# EAGLE schematic firefly-instrument-tray (EAGLE 7.7.0)

## Sheet 1 of 8
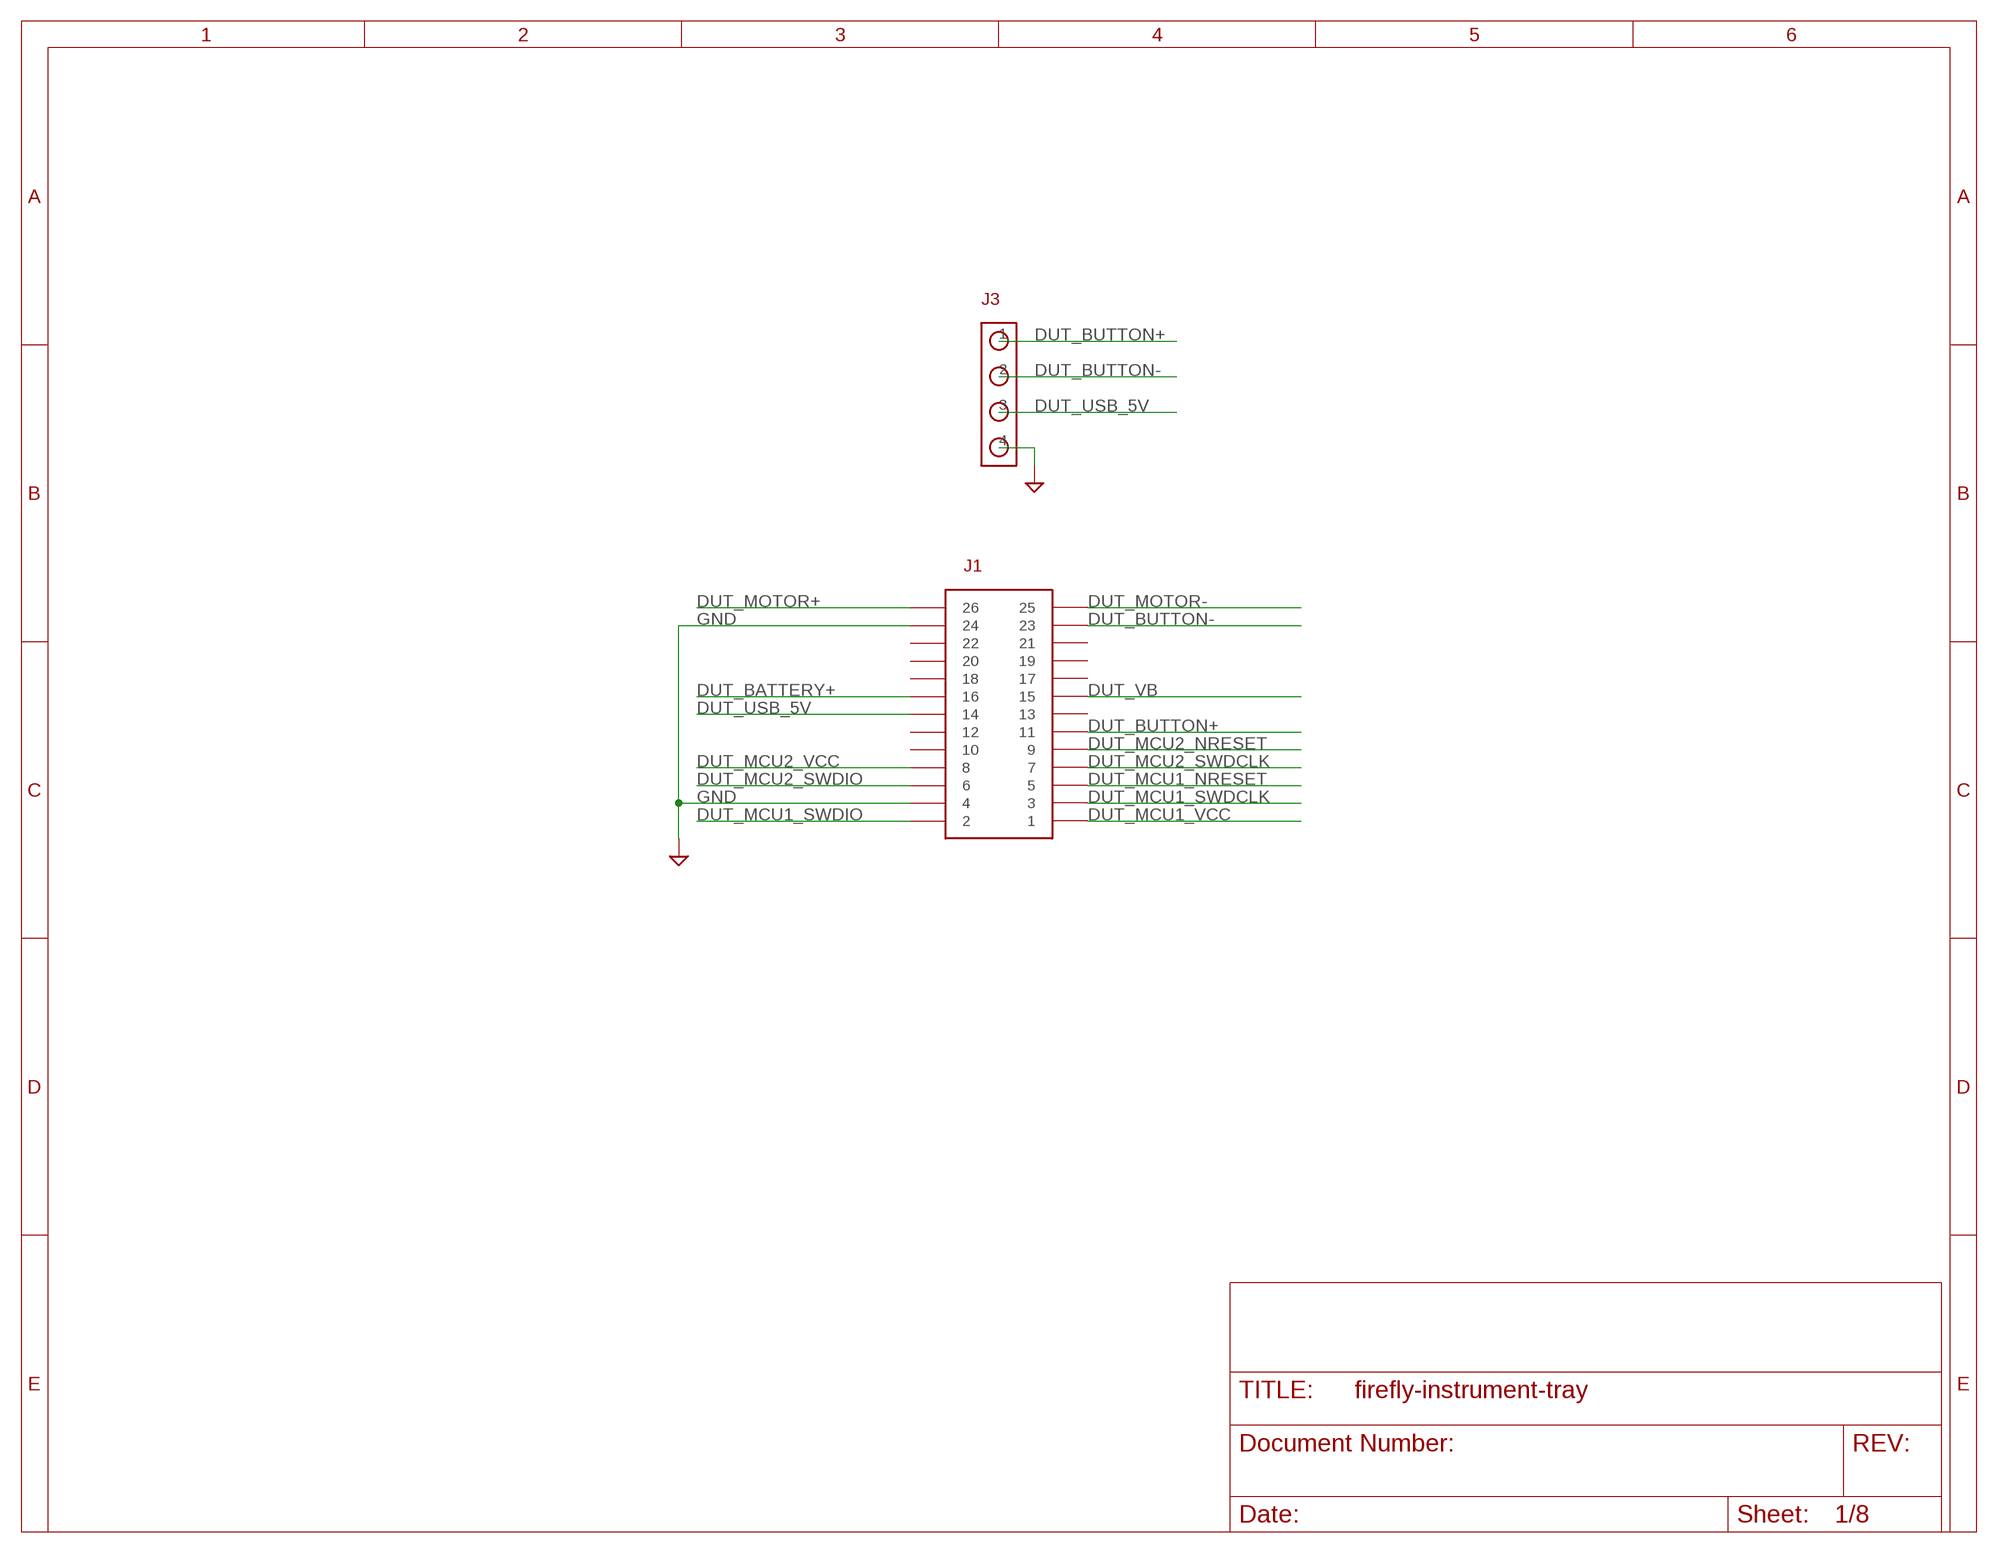
[diagram p0: schematic, sheet 1]

### Parts
J1  CON-26  [CON-HEADER-2X13]
J3  CON-4282847-4  [282847-4]

### Nets
DUT_BATTERY+: J1.16 ; also sheet 3
DUT_BUTTON+: J1.11 J3.1 ; also sheet 2
DUT_BUTTON-: J1.23 J3.2 ; also sheet 2
DUT_MCU1_NRESET: J1.5 ; also sheet 2
DUT_MCU1_SWDCLK: J1.3 ; also sheet 2
DUT_MCU1_SWDIO: J1.2 ; also sheet 2
DUT_MCU1_VCC: J1.1 ; also sheet 2
DUT_MCU2_NRESET: J1.9 ; also sheet 2
DUT_MCU2_SWDCLK: J1.7 ; also sheet 2
DUT_MCU2_SWDIO: J1.6 ; also sheet 2
DUT_MCU2_VCC: J1.8 ; also sheet 2
DUT_MOTOR+: J1.26 ; also sheet 2
DUT_MOTOR-: J1.25 ; also sheet 2
DUT_USB_5V: J1.14 J3.3 ; also sheet 4
DUT_VB: J1.15 ; also sheet 2
GND: J1.4 J1.24 J3.4 ; also sheet 2,3,4,5,6,7,8
Unconnected: J1.10 J1.12 J1.13 J1.17 J1.18 J1.19 J1.20 J1.21 J1.22

## Sheet 2 of 8
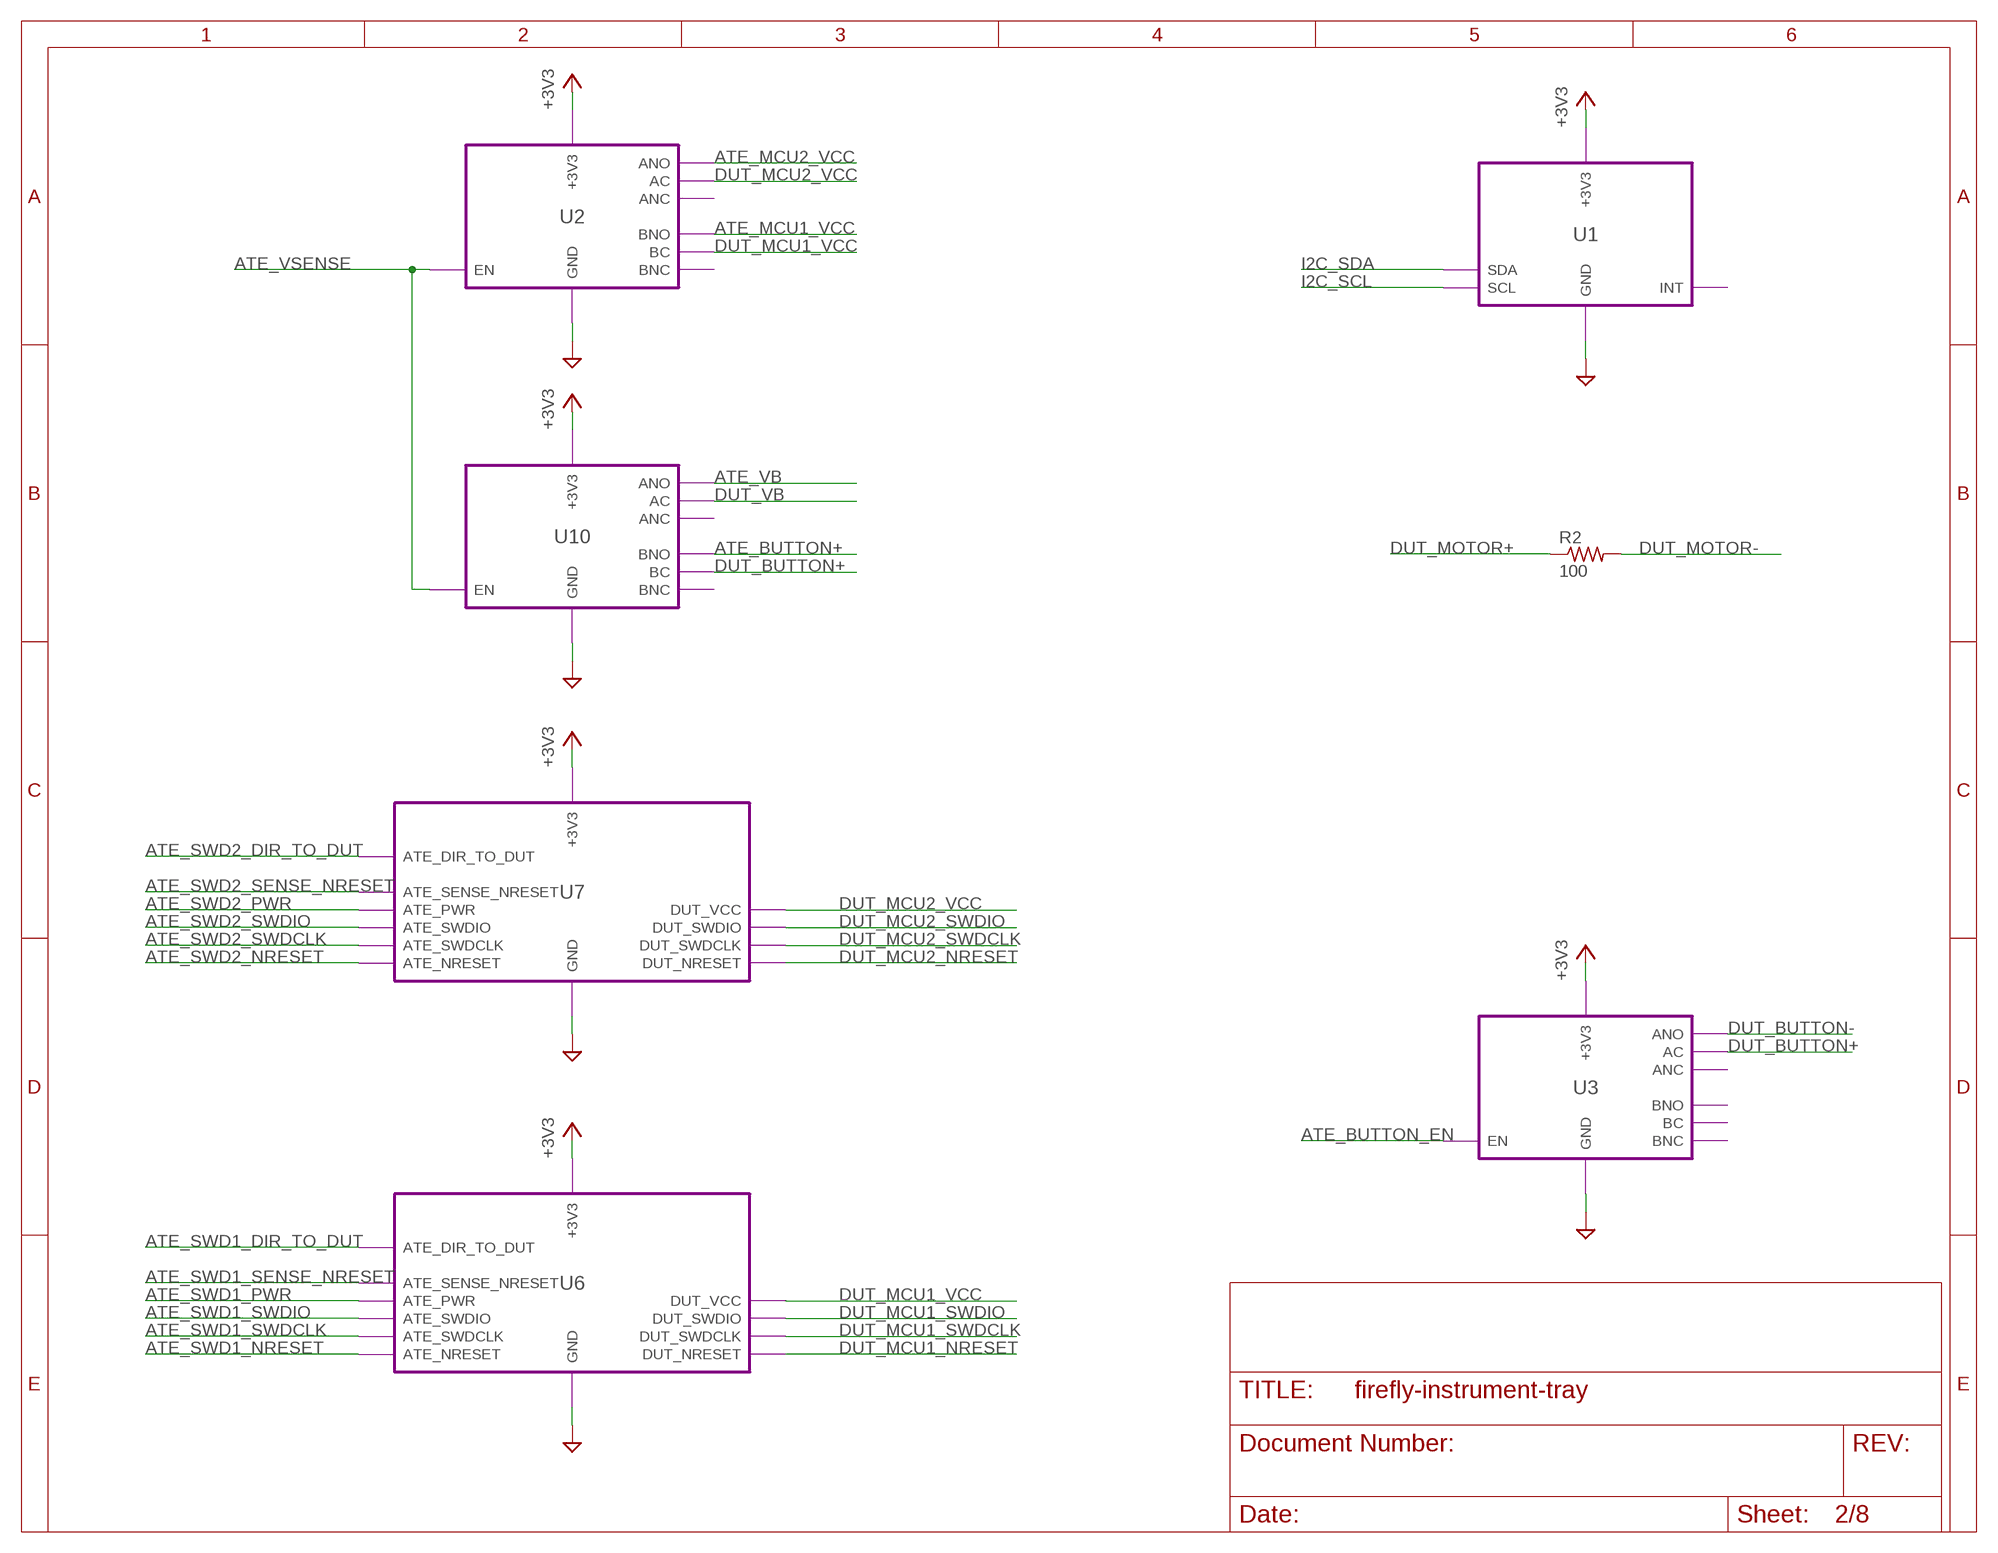
[diagram p1: schematic, sheet 2]

### Parts
R2  100  R-USRW0S6BB  [RW0S6BB]

### Module instances
U6 = SERIAL_WIRE_DEBUG
U3 = RELAY
U7 = SERIAL_WIRE_DEBUG
U1 = COLOR_SENSOR
U2 = RELAY
U10 = RELAY

### Nets
+3V3: port U1.+3V3 U6.+3V3 U7.+3V3 U3.+3V3 U2.+3V3 U10.+3V3 ; also sheet 3,4,5,6,7,8
ATE_BUTTON+: port U10.BNO ; also sheet 6
ATE_BUTTON_EN: port U3.EN ; also sheet 5
ATE_MCU1_VCC: port U2.BNO ; also sheet 6
ATE_MCU2_VCC: port U2.ANO ; also sheet 6
ATE_SWD1_DIR_TO_DUT: port U6.ATE_DIR_TO_DUT ; also sheet 5
ATE_SWD1_NRESET: port U6.ATE_NRESET ; also sheet 5
ATE_SWD1_PWR: port U6.ATE_PWR ; also sheet 5
ATE_SWD1_SENSE_NRESET: port U6.ATE_SENSE_NRESET ; also sheet 5
ATE_SWD1_SWDCLK: port U6.ATE_SWDCLK ; also sheet 5
ATE_SWD1_SWDIO: port U6.ATE_SWDIO ; also sheet 5
ATE_SWD2_DIR_TO_DUT: port U7.ATE_DIR_TO_DUT ; also sheet 5
ATE_SWD2_NRESET: port U7.ATE_NRESET ; also sheet 5
ATE_SWD2_PWR: port U7.ATE_PWR ; also sheet 5
ATE_SWD2_SENSE_NRESET: port U7.ATE_SENSE_NRESET ; also sheet 5
ATE_SWD2_SWDCLK: port U7.ATE_SWDCLK ; also sheet 5
ATE_SWD2_SWDIO: port U7.ATE_SWDIO ; also sheet 5
ATE_VB: port U10.ANO ; also sheet 6
ATE_VSENSE: port U10.EN U2.EN ; also sheet 5
DUT_BUTTON+: port U3.AC U10.BC ; also sheet 1
DUT_BUTTON-: port U3.ANO ; also sheet 1
DUT_MCU1_NRESET: port U6.DUT_NRESET ; also sheet 1
DUT_MCU1_SWDCLK: port U6.DUT_SWDCLK ; also sheet 1
DUT_MCU1_SWDIO: port U6.DUT_SWDIO ; also sheet 1
DUT_MCU1_VCC: port U6.DUT_VCC U2.BC ; also sheet 1
DUT_MCU2_NRESET: port U7.DUT_NRESET ; also sheet 1
DUT_MCU2_SWDCLK: port U7.DUT_SWDCLK ; also sheet 1
DUT_MCU2_SWDIO: port U7.DUT_SWDIO ; also sheet 1
DUT_MCU2_VCC: port U7.DUT_VCC U2.AC ; also sheet 1
DUT_MOTOR+: R2.1 ; also sheet 1
DUT_MOTOR-: R2.2 ; also sheet 1
DUT_VB: port U10.AC ; also sheet 1
GND: port U1.GND U6.GND U7.GND U3.GND U2.GND U10.GND ; also sheet 1,3,4,5,6,7,8
I2C_SCL: port U1.SCL ; also sheet 3,4,5,7
I2C_SDA: port U1.SDA ; also sheet 3,4,5,7

## Sheet 3 of 8
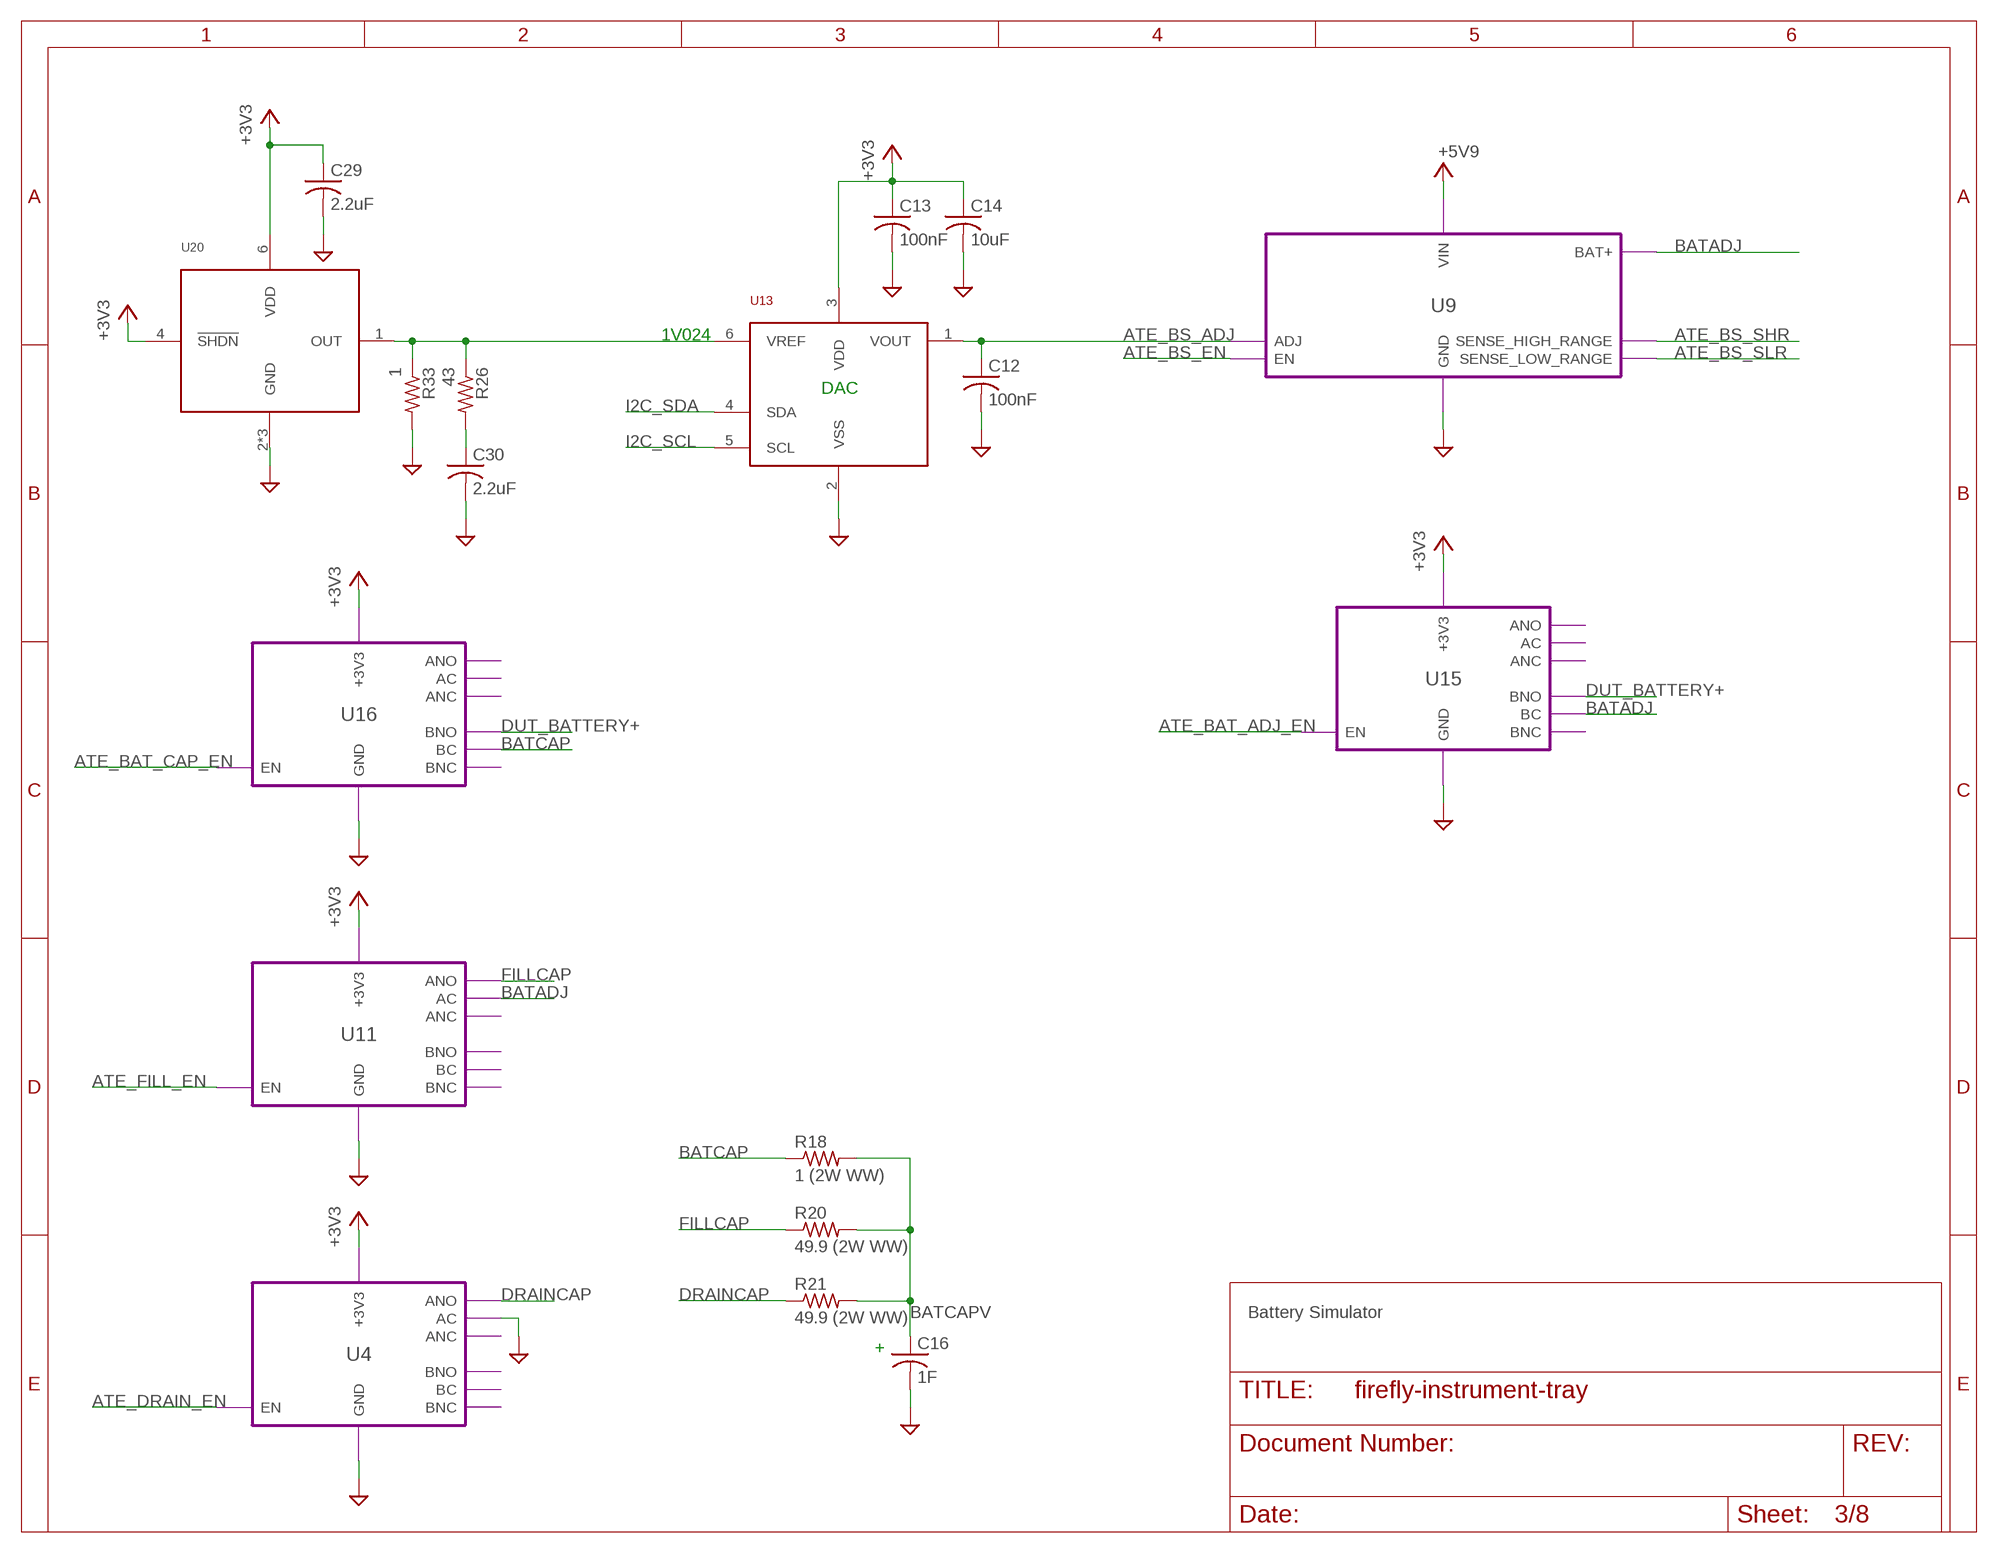
[diagram p2: schematic, sheet 3]

### Parts
C12  100nF  C-USC0805  [C0805]
C13  100nF  C-USC0805  [C0805]
C14  10uF  C-USC0805  [C0805]
C16  1F  C-USPM118  [PM118]
C29  2.2uF  C-USC0805  [C0805]
C30  2.2uF  C-USC0805  [C0805]
R18  1 (2W WW)  R-USRCL1225  [RCL1225]
R20  49.9 (2W WW)  R-USKRL6432  [KRL6432]
R21  49.9 (2W WW)  R-USRCL1225  [RCL1225]
R26  43  R-USR0805  [R0805]
R33  1  R-USR0805  [R0805]
U13  MCP47X6  [SOT-23-6]
U20  MCP1501  [SOT-23-6]

### Module instances
U9 = POWER_SUPPLY
U4 = RELAY
U11 = RELAY
U15 = RELAY
U16 = RELAY

### Nets
+3V3: C13.1 C14.1 C29.1 U13.3(VDD) U20.4(!SHDN) U20.6(VDD) ; port U4.+3V3 U15.+3V3 U16.+3V3 U11.+3V3 ; also sheet 2,4,5,6,7,8
+5V9: port U9.VIN ; also sheet 4,7
ATE_BAT_ADJ_EN: port U15.EN ; also sheet 5
ATE_BAT_CAP_EN: port U16.EN ; also sheet 5
ATE_BS_ADJ: C12.1 U13.1(VOUT) ; port U9.ADJ
ATE_BS_EN: port U9.EN ; also sheet 5
ATE_BS_SHR: port U9.SENSE_HIGH_RANGE ; also sheet 5
ATE_BS_SLR: port U9.SENSE_LOW_RANGE ; also sheet 5
ATE_DRAIN_EN: port U4.EN ; also sheet 5
ATE_FILL_EN: port U11.EN ; also sheet 5
BATADJ: port U9.BAT+ U11.AC U15.BC ; also sheet 6
BATCAP: R18.1 ; port U16.BC
BATCAPV: C16.+ R18.2 R20.2 R21.2 ; also sheet 6
DRAINCAP: R21.1 ; port U4.ANO
DUT_BATTERY+: port U15.BNO U16.BNO ; also sheet 1
FILLCAP: R20.1 ; port U11.ANO
GND: C12.2 C13.2 C14.2 C16.- C29.2 C30.2 R33.2 U13.2(VSS) U20.2(GND) U20.3(GND) U20.5(GND) ; port U9.GND U4.AC U11.GND U4.GND U15.GND U16.GND ; also sheet 1,2,4,5,6,7,8
I2C_SCL: U13.5(SCL) ; also sheet 2,4,5,7
I2C_SDA: U13.4(SDA) ; also sheet 2,4,5,7
N$22: R26.1 R33.1 U13.6(VREF) U20.1(OUT)
N$30: C30.1 R26.2

### Notes on the sheet
- 1V024
- DAC
- Battery Simulator
- +

## Sheet 4 of 8
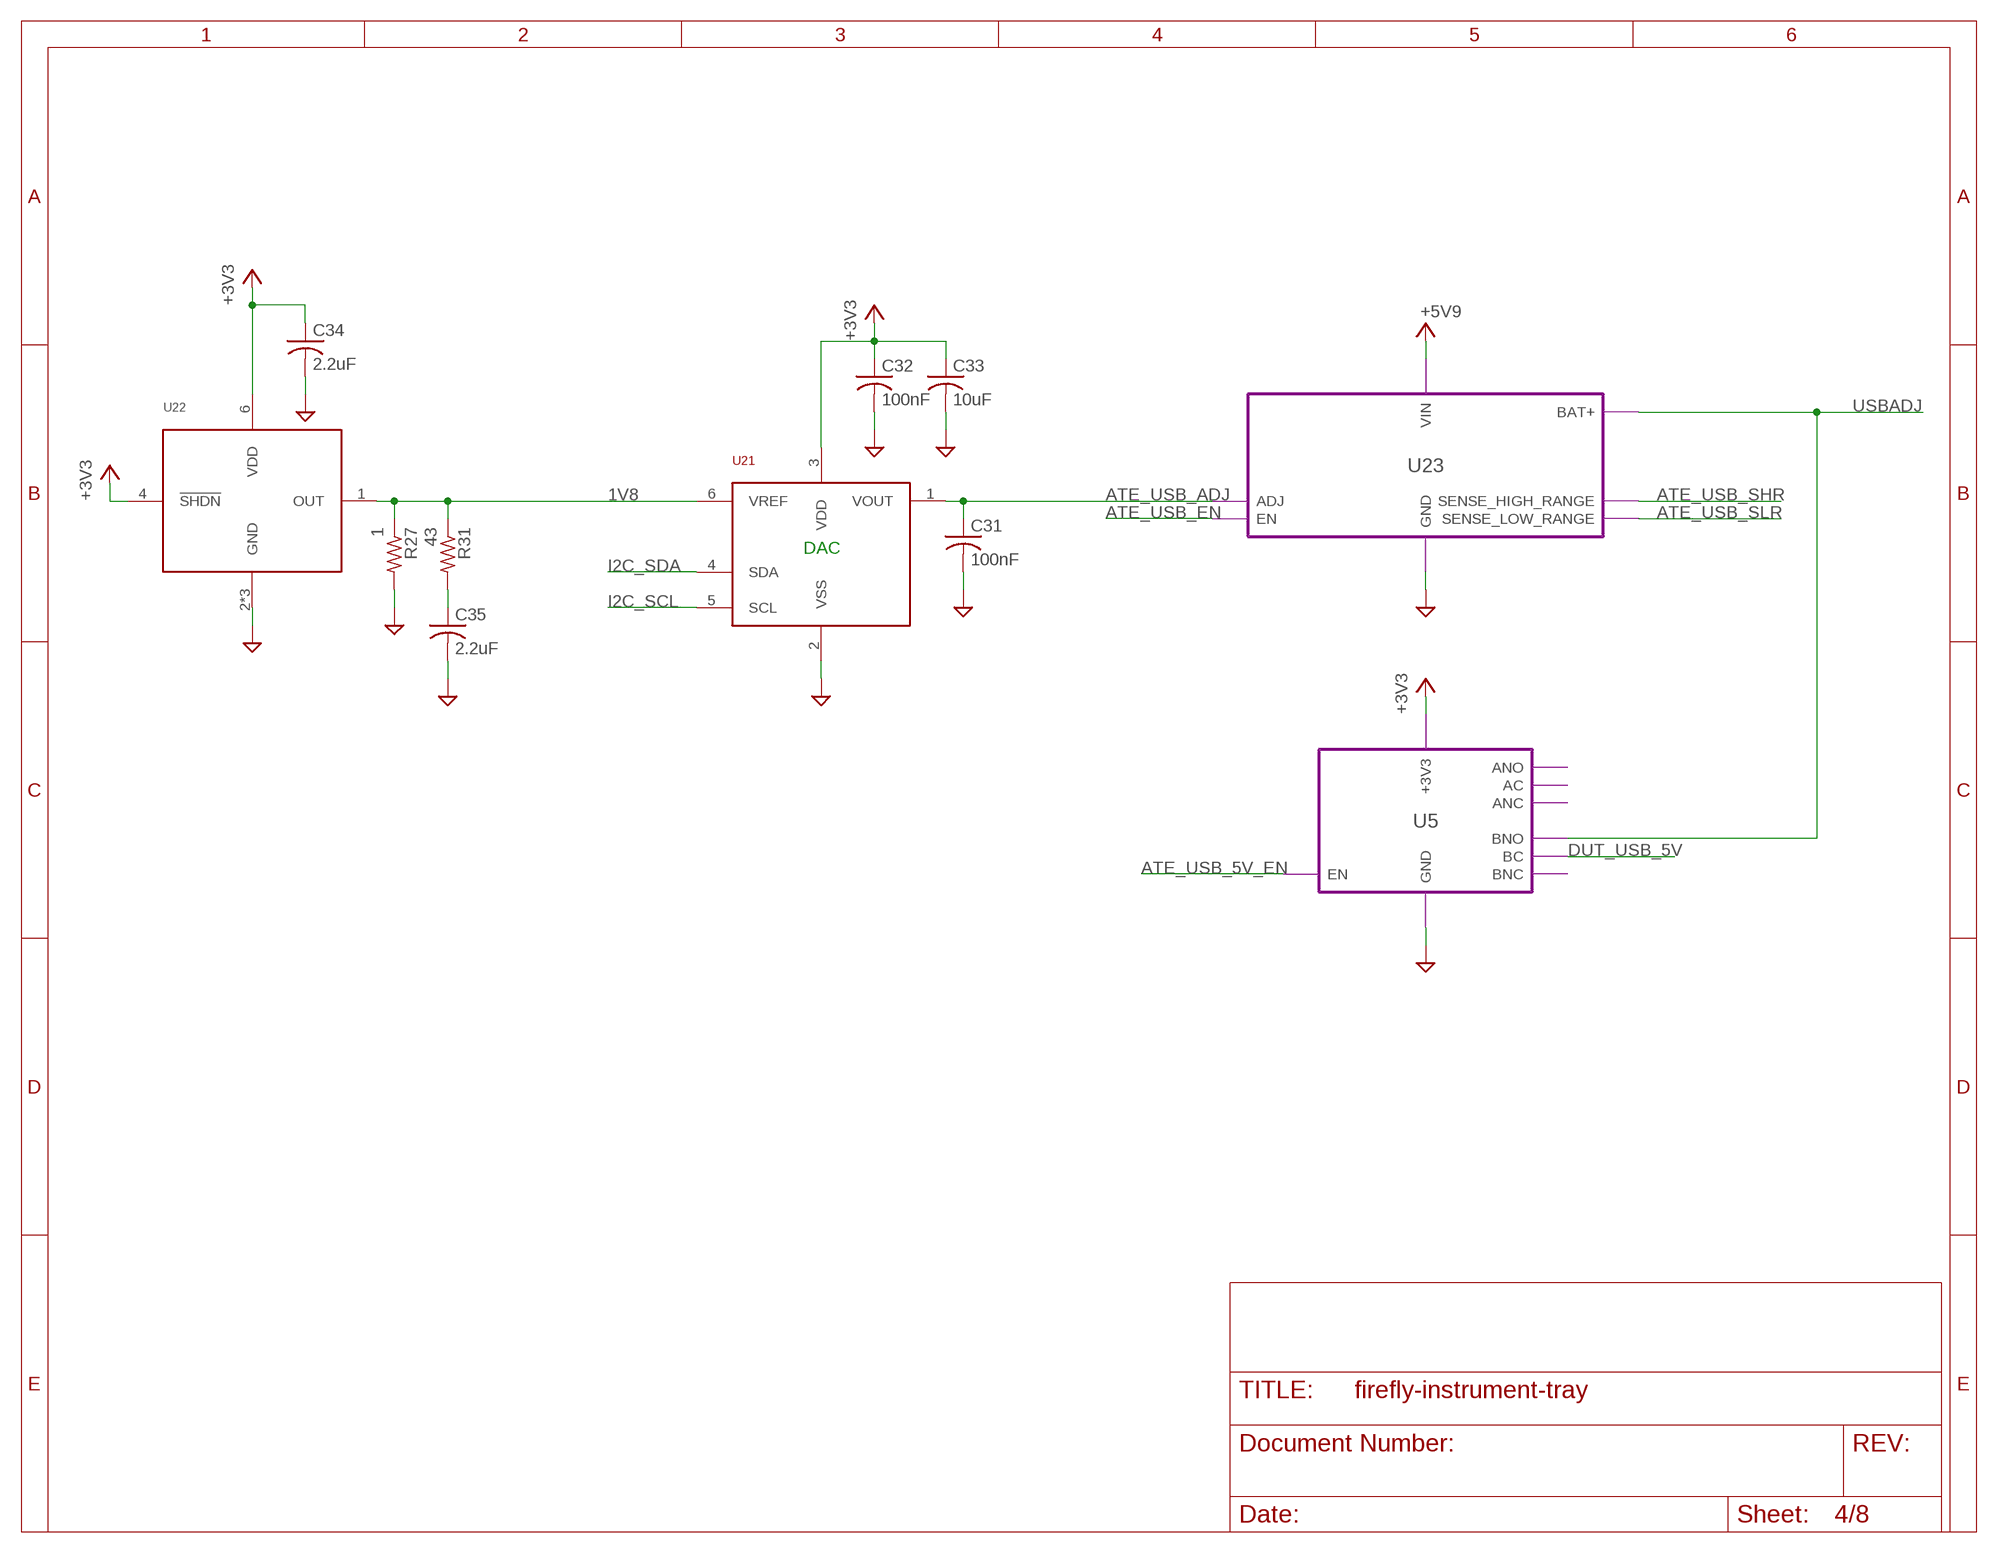
[diagram p3: schematic, sheet 4]

### Parts
C31  100nF  C-USC0805  [C0805]
C32  100nF  C-USC0805  [C0805]
C33  10uF  C-USC0805  [C0805]
C34  2.2uF  C-USC0805  [C0805]
C35  2.2uF  C-USC0805  [C0805]
R27  1  R-USR0805  [R0805]
R31  43  R-USR0805  [R0805]
U21  MCP47X6  [SOT-23-6]
U22  MCP1501  [SOT-23-6]

### Module instances
U5 = RELAY
U23 = POWER_SUPPLY

### Nets
+3V3: C32.1 C33.1 C34.1 U21.3(VDD) U22.4(!SHDN) U22.6(VDD) ; port U5.+3V3 ; also sheet 2,3,5,6,7,8
+5V9: port U23.VIN ; also sheet 3,7
ATE_USB_5V_EN: port U5.EN ; also sheet 5
ATE_USB_ADJ: C31.1 U21.1(VOUT) ; port U23.ADJ
ATE_USB_EN: port U23.EN ; also sheet 5
ATE_USB_SHR: port U23.SENSE_HIGH_RANGE ; also sheet 5
ATE_USB_SLR: port U23.SENSE_LOW_RANGE ; also sheet 5
DUT_USB_5V: port U5.BC ; also sheet 1
GND: C31.2 C32.2 C33.2 C34.2 C35.2 R27.2 U21.2(VSS) U22.2(GND) U22.3(GND) U22.5(GND) ; port U23.GND U5.GND ; also sheet 1,2,3,5,6,7,8
I2C_SCL: U21.5(SCL) ; also sheet 2,3,5,7
I2C_SDA: U21.4(SDA) ; also sheet 2,3,5,7
N$36: R27.1 R31.1 U21.6(VREF) U22.1(OUT)
N$38: C35.1 R31.2
USBADJ: port U23.BAT+ U5.BNO ; also sheet 6

### Notes on the sheet
- 1V8
- DAC

## Sheet 5 of 8
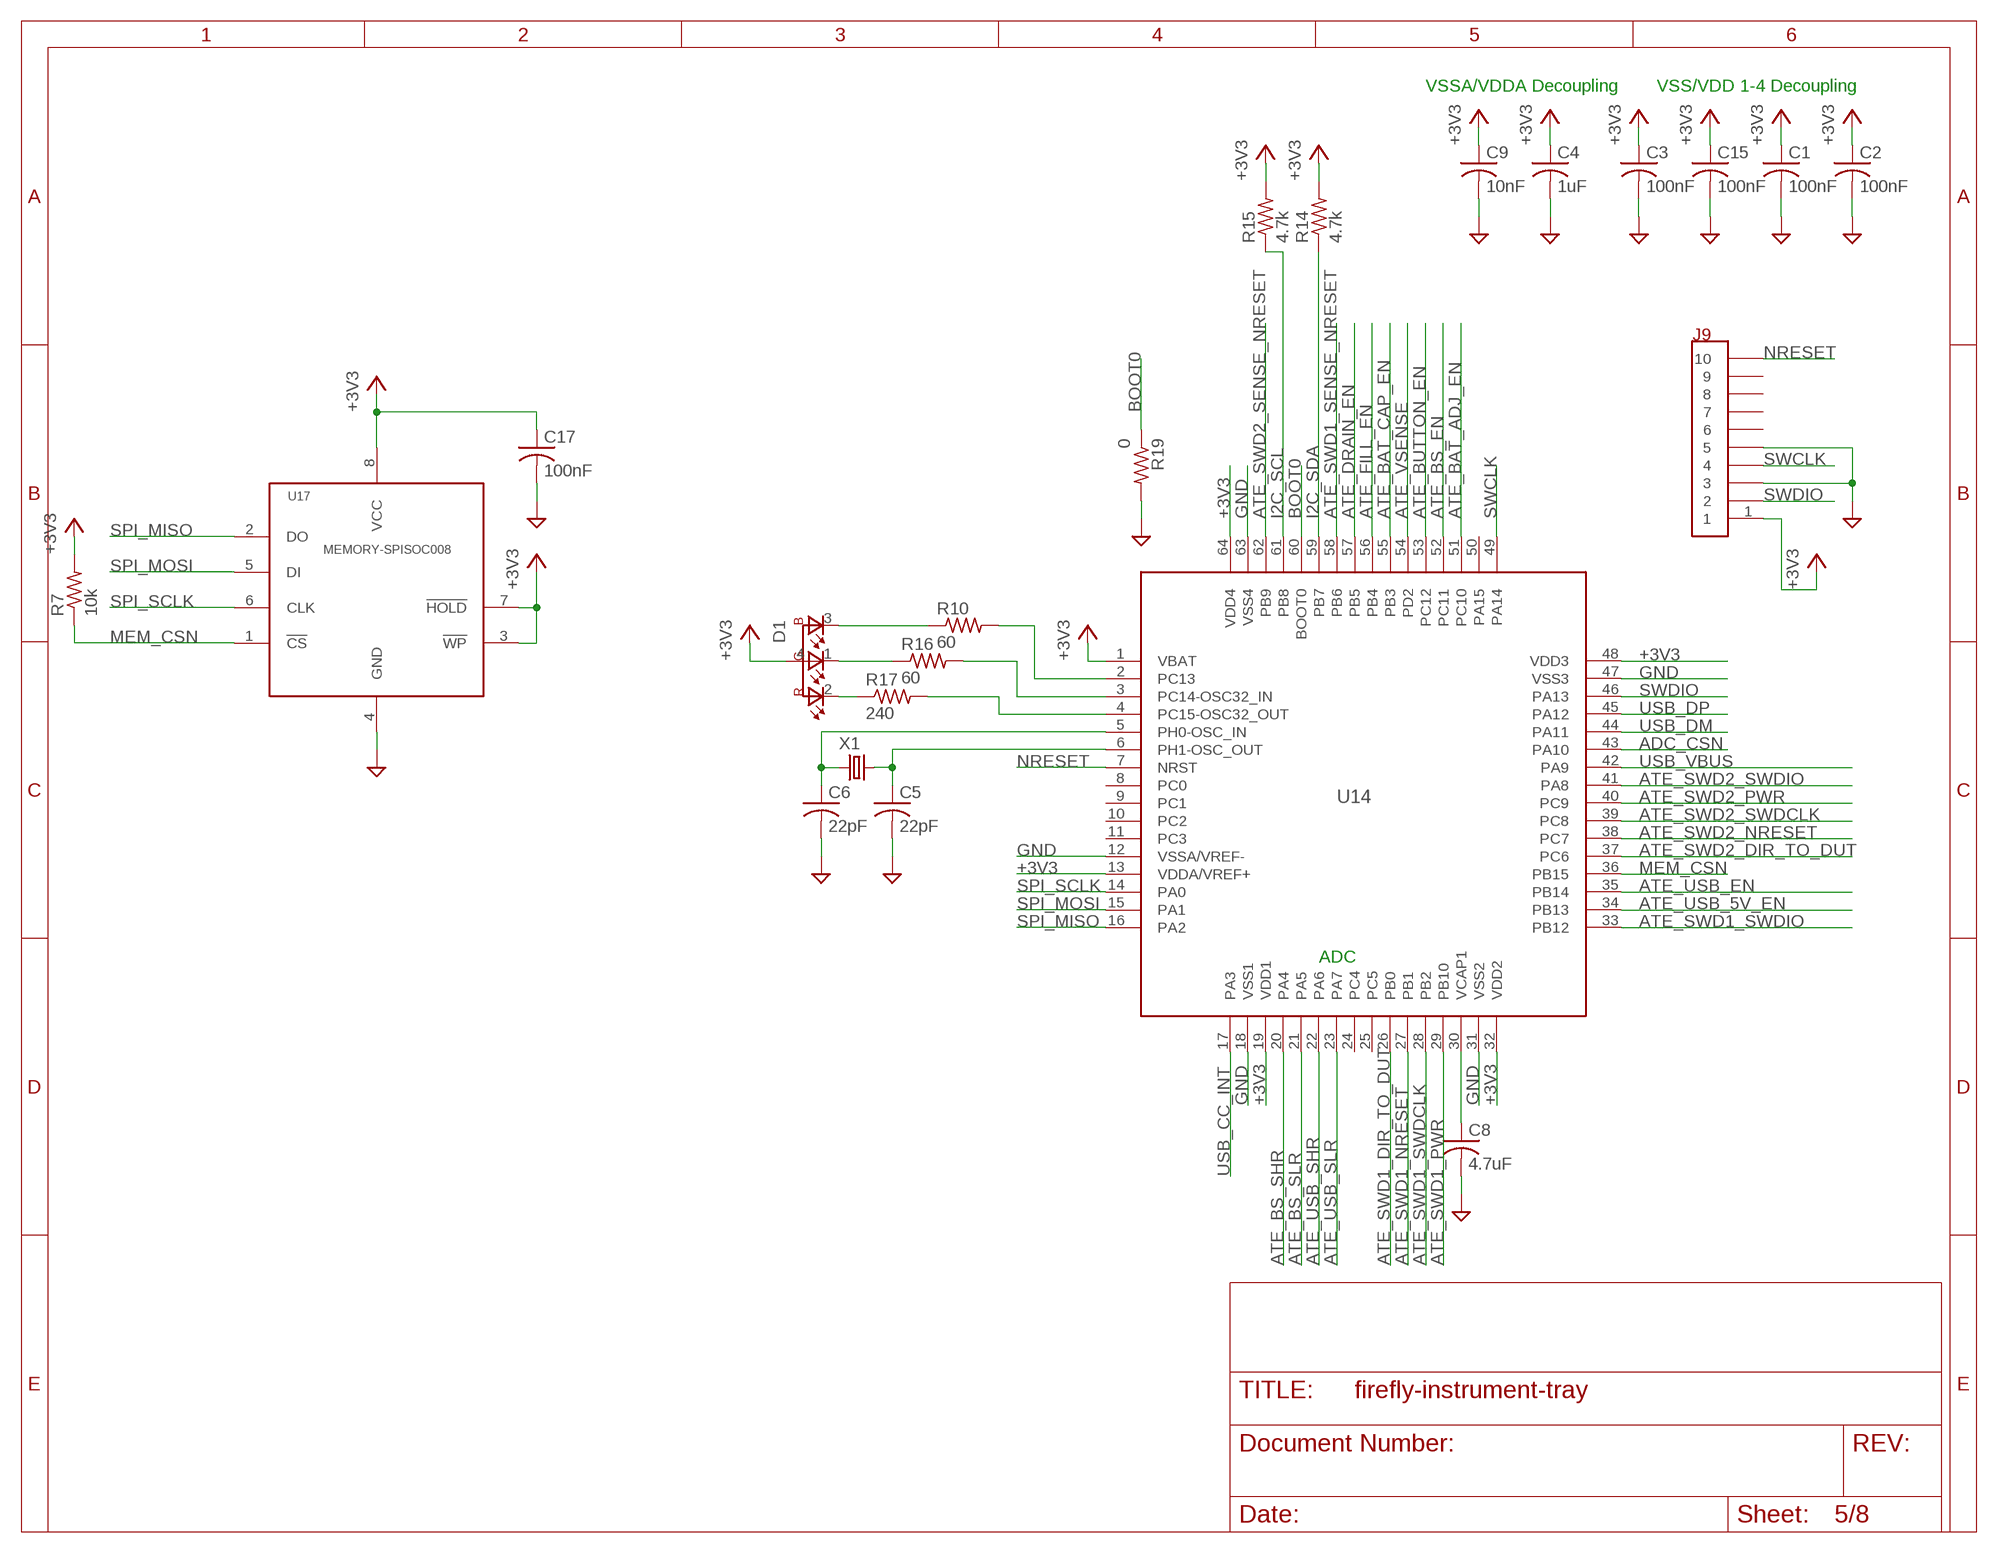
[diagram p4: schematic, sheet 5]

### Parts
C1  100nF  C-USC0805  [C0805]
C2  100nF  C-USC0805  [C0805]
C3  100nF  C-USC0805  [C0805]
C4  1uF  C-USC0805  [C0805]
C5  22pF  C-USC0805  [C0805]
C6  22pF  C-USC0805  [C0805]
C8  4.7uF  C-USC0805  [C0805]
C9  10nF  C-USC0805  [C0805]
C15  100nF  C-USC0805  [C0805]
C17  100nF  C-USC0805  [C0805]
D1  LED-RGB-CAMSL0201RGB  [MSL0201RGB]
J9  CON-10SWD  [SWD-10]
R7  10k  R-USR0805  [R0805]
R10  60  R-USR0805  [R0805]
R14  4.7k  R-USR0805  [R0805]
R15  4.7k  R-USR0805  [R0805]
R16  60  R-USR0805  [R0805]
R17  240  R-USR0805  [R0805]
R19  0  R-USR0805  [R0805]
U14  STM32F411-LQFP64  [LQFP-64]
U17  MEMORY-SPISOC008  [SOC008]
X1  XTAL2TXC_7A  [TXC_7A]

### Nets
+3V3: C1.1 C2.1 C3.1 C4.1 C9.1 C15.1 C17.1 D1.4(A) J9.1 R7.2 R14.2 R15.2 U14.1(VBAT) U14.13(VDDA/VREF+) U14.19(VDD1) U14.32(VDD2) U14.48(VDD3) U14.64(VDD4) U17.3(!WP) U17.7(!HOLD) U17.8(VCC) ; also sheet 2,3,4,6,7,8
ADC_CSN: U14.43(PA10) ; also sheet 6
ATE_BAT_ADJ_EN: U14.51(PC10) ; also sheet 3
ATE_BAT_CAP_EN: U14.55(PB3) ; also sheet 3
ATE_BS_EN: U14.52(PC11) ; also sheet 3
ATE_BS_SHR: U14.20(PA4) ; also sheet 3
ATE_BS_SLR: U14.21(PA5) ; also sheet 3
ATE_BUTTON_EN: U14.53(PC12) ; also sheet 2
ATE_DRAIN_EN: U14.57(PB5) ; also sheet 3
ATE_FILL_EN: U14.56(PB4) ; also sheet 3
ATE_SWD1_DIR_TO_DUT: U14.26(PB0) ; also sheet 2
ATE_SWD1_NRESET: U14.27(PB1) ; also sheet 2
ATE_SWD1_PWR: U14.29(PB10) ; also sheet 2
ATE_SWD1_SENSE_NRESET: U14.58(PB6) ; also sheet 2
ATE_SWD1_SWDCLK: U14.28(PB2) ; also sheet 2
ATE_SWD1_SWDIO: U14.33(PB12) ; also sheet 2
ATE_SWD2_DIR_TO_DUT: U14.37(PC6) ; also sheet 2
ATE_SWD2_NRESET: U14.38(PC7) ; also sheet 2
ATE_SWD2_PWR: U14.40(PC9) ; also sheet 2
ATE_SWD2_SENSE_NRESET: U14.62(PB9) ; also sheet 2
ATE_SWD2_SWDCLK: U14.39(PC8) ; also sheet 2
ATE_SWD2_SWDIO: U14.41(PA8) ; also sheet 2
ATE_USB_5V_EN: U14.34(PB13) ; also sheet 4
ATE_USB_EN: U14.35(PB14) ; also sheet 4
ATE_USB_SHR: U14.22(PA6) ; also sheet 4
ATE_USB_SLR: U14.23(PA7) ; also sheet 4
ATE_VSENSE: U14.54(PD2) ; also sheet 2
BOOT0: R19.1 U14.60(BOOT0)
GND: C1.2 C2.2 C3.2 C4.2 C5.2 C6.2 C8.2 C9.2 C15.2 C17.2 J9.3 J9.5 R19.2 U14.12(VSSA/VREF-) U14.18(VSS1) U14.31(VSS2) U14.47(VSS3) U14.63(VSS4) U17.4(GND) ; also sheet 1,2,3,4,6,7,8
I2C_SCL: R15.1 U14.61(PB8) ; also sheet 2,3,4,7
I2C_SDA: R14.1 U14.59(PB7) ; also sheet 2,3,4,7
MEM_CSN: R7.1 U14.36(PB15) U17.1(!CS)
N$1: R10.2 U14.2(PC13)
N$5: C5.1 U14.6(PH1-OSC_OUT) X1.2
N$6: C6.1 U14.5(PH0-OSC_IN) X1.1
N$7: R16.2 U14.3(PC14-OSC32_IN)
N$10: C8.1 U14.30(VCAP1)
N$13: R17.2 U14.4(PC15-OSC32_OUT)
N$15: D1.3(B) R10.1
N$16: D1.1(G) R16.1
N$17: D1.2(R) R17.1
NRESET: J9.10 U14.7(NRST)
SPI_MISO: U14.16(PA2) U17.2(DO) ; also sheet 6
SPI_MOSI: U14.15(PA1) U17.5(DI) ; also sheet 6
SPI_SCLK: U14.14(PA0) U17.6(CLK) ; also sheet 6
SWCLK: J9.4 U14.49(PA14)
SWDIO: J9.2 U14.46(PA13)
USB_CC_INT: U14.17(PA3) ; also sheet 7
USB_DM: U14.44(PA11) ; also sheet 7,8
USB_DP: U14.45(PA12) ; also sheet 7,8
USB_VBUS: U14.42(PA9) ; also sheet 8
Unconnected: J9.6 J9.7 J9.8 J9.9 U14.8(PC0) U14.9(PC1) U14.10(PC2) U14.11(PC3) U14.24(PC4) U14.25(PC5) U14.50(PA15)

### Notes on the sheet
- VSSA/VDDA Decoupling | VSS/VDD 1-4 Decoupling
- ADC

## Sheet 6 of 8
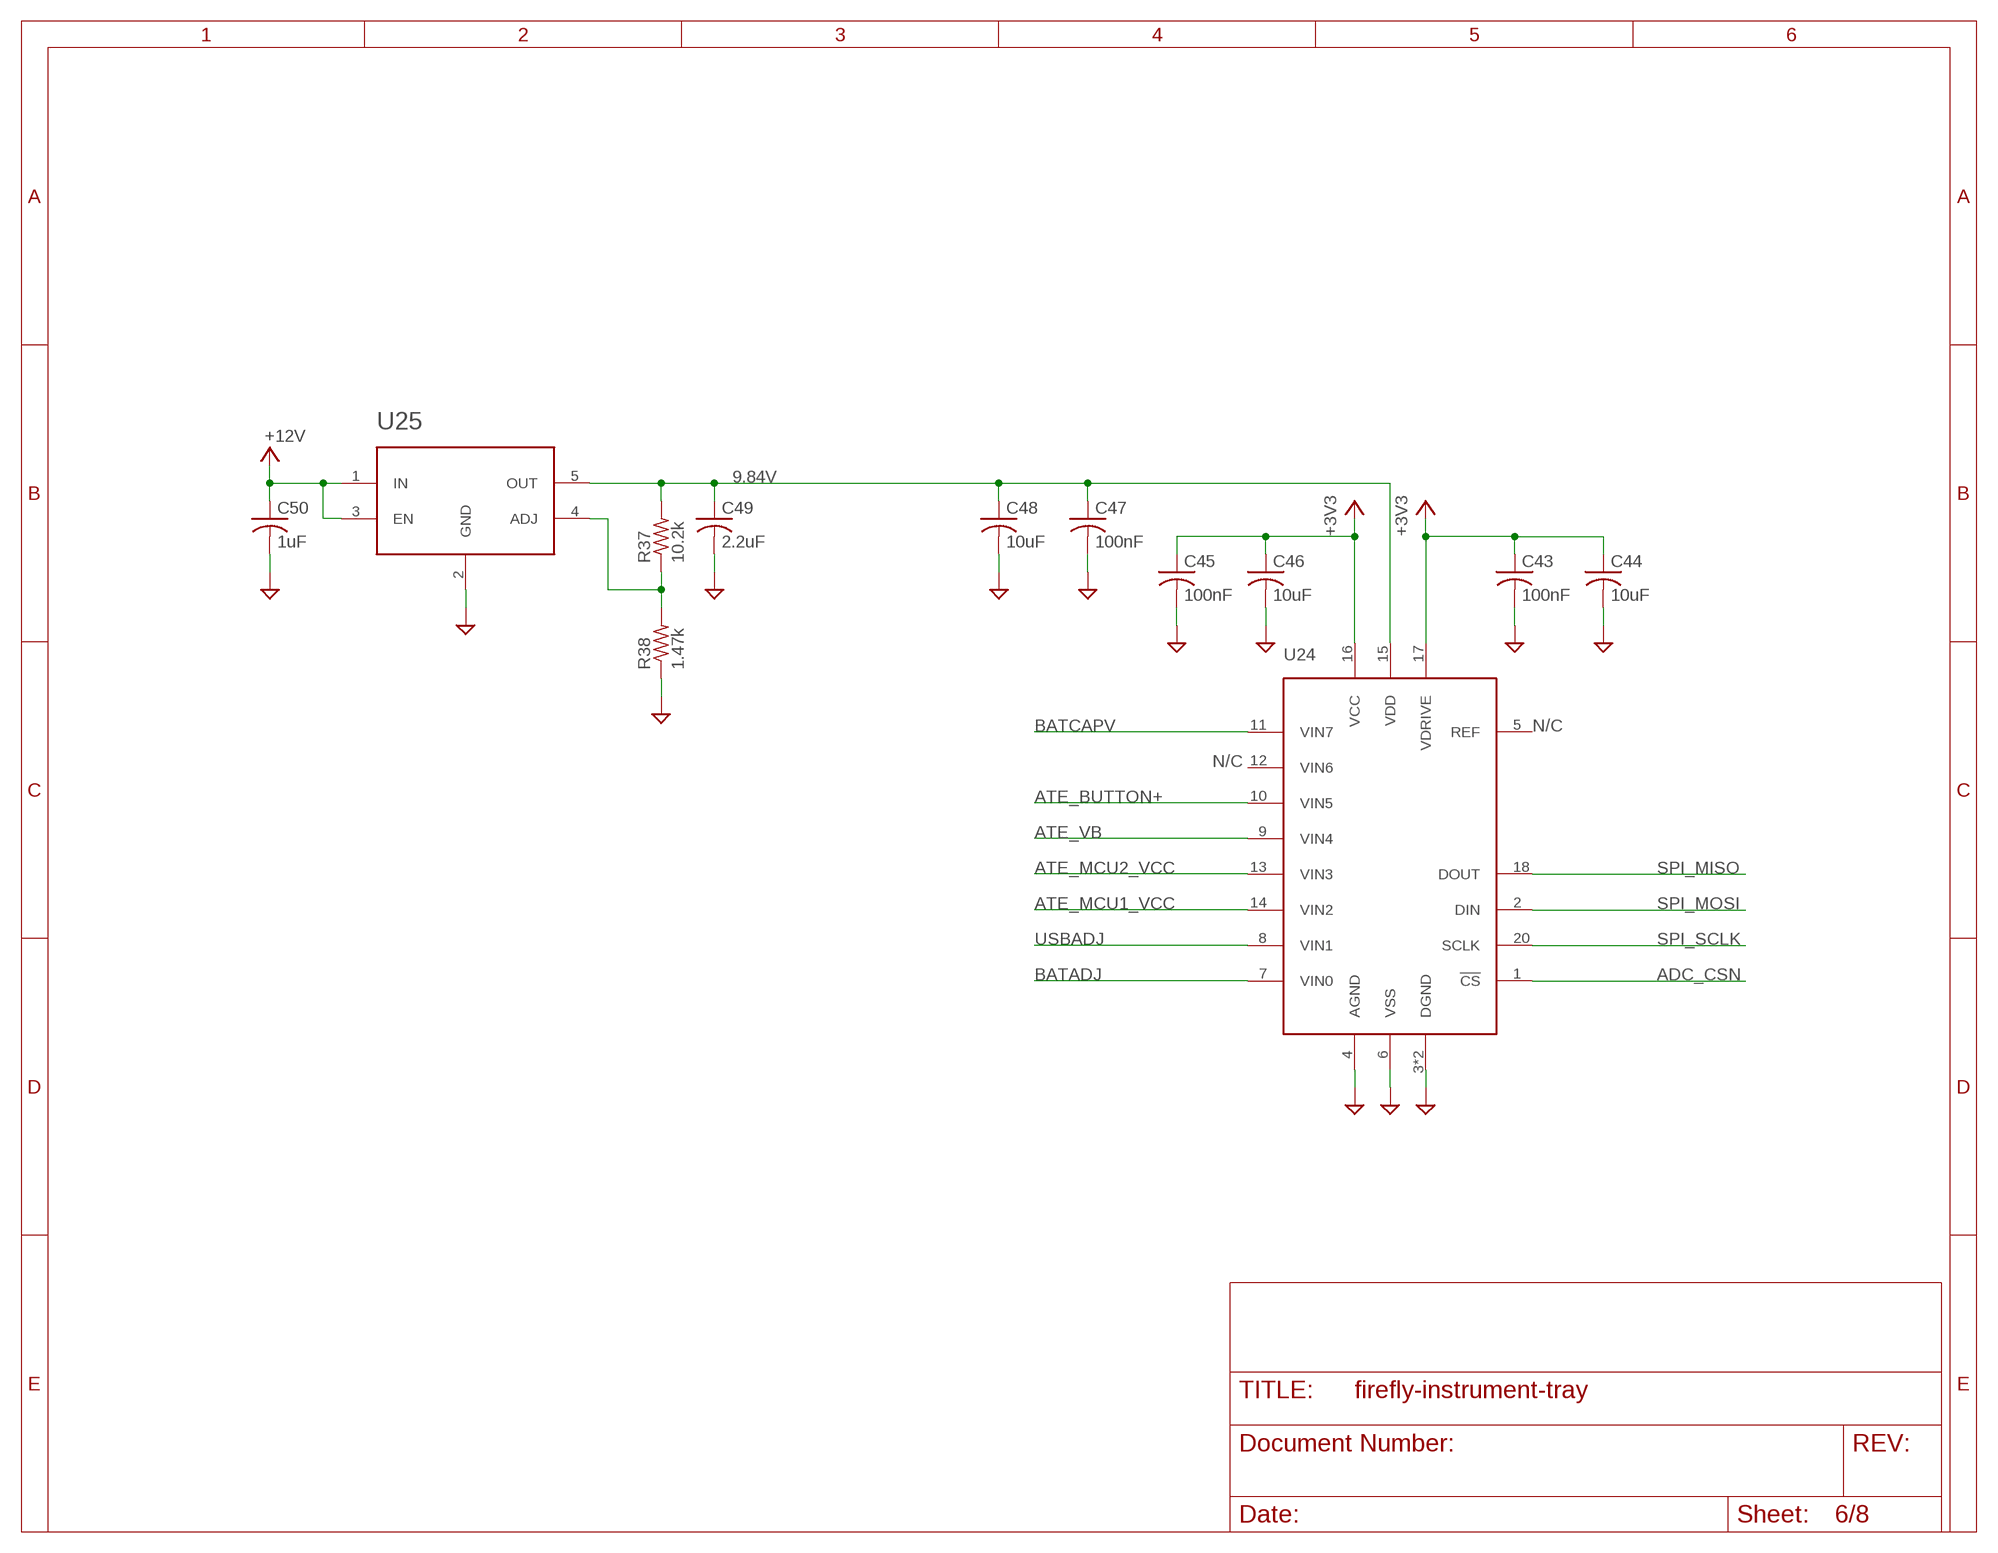
[diagram p5: schematic, sheet 6]

### Parts
C43  100nF  C-USC0805  [C0805]
C44  10uF  C-USC0805  [C0805]
C45  100nF  C-USC0805  [C0805]
C46  10uF  C-USC0805  [C0805]
C47  100nF  C-USC0805  [C0805]
C48  10uF  C-USC0805  [C0805]
C49  2.2uF  C-USC0805  [C0805]
C50  1uF  C-USC0805  [C0805]
R37  10.2k  R-USR0805  [R0805]
R38  1.47k  R-USR0805  [R0805]
U24  AD7327  [TSSOP-20]
U25  VREG-ADJAP2204  [SOT-23-5]

### Nets
+3V3: C43.1 C44.1 C45.1 C46.1 U24.16(VCC) U24.17(VDRIVE) ; also sheet 2,3,4,5,7,8
+12V: C50.1 U25.1(IN) U25.3(EN) ; also sheet 7,8
ADC_CSN: U24.1(!CS) ; also sheet 5
ATE_BUTTON+: U24.10(VIN5) ; also sheet 2
ATE_MCU1_VCC: U24.14(VIN2) ; also sheet 2
ATE_MCU2_VCC: U24.13(VIN3) ; also sheet 2
ATE_VB: U24.9(VIN4) ; also sheet 2
BATADJ: U24.7(VIN0) ; also sheet 3
BATCAPV: U24.11(VIN7) ; also sheet 3
GND: C43.2 C44.2 C45.2 C46.2 C47.2 C48.2 C49.2 C50.2 R38.1 U24.3(DGND) U24.4(AGND) U24.6(VSS) U24.19(DGND) U25.2(GND) ; also sheet 1,2,3,4,5,7,8
N$47: C47.1 C48.1 C49.1 R37.2 U24.15(VDD) U25.5(OUT)
N$49: R37.1 R38.2 U25.4(ADJ)
SPI_MISO: U24.18(DOUT) ; also sheet 5
SPI_MOSI: U24.2(DIN) ; also sheet 5
SPI_SCLK: U24.20(SCLK) ; also sheet 5
USBADJ: U24.8(VIN1) ; also sheet 4
Unconnected: U24.5(REF) U24.12(VIN6)

### Notes on the sheet
- 9.84V
- N/C
- N/C

## Sheet 7 of 8
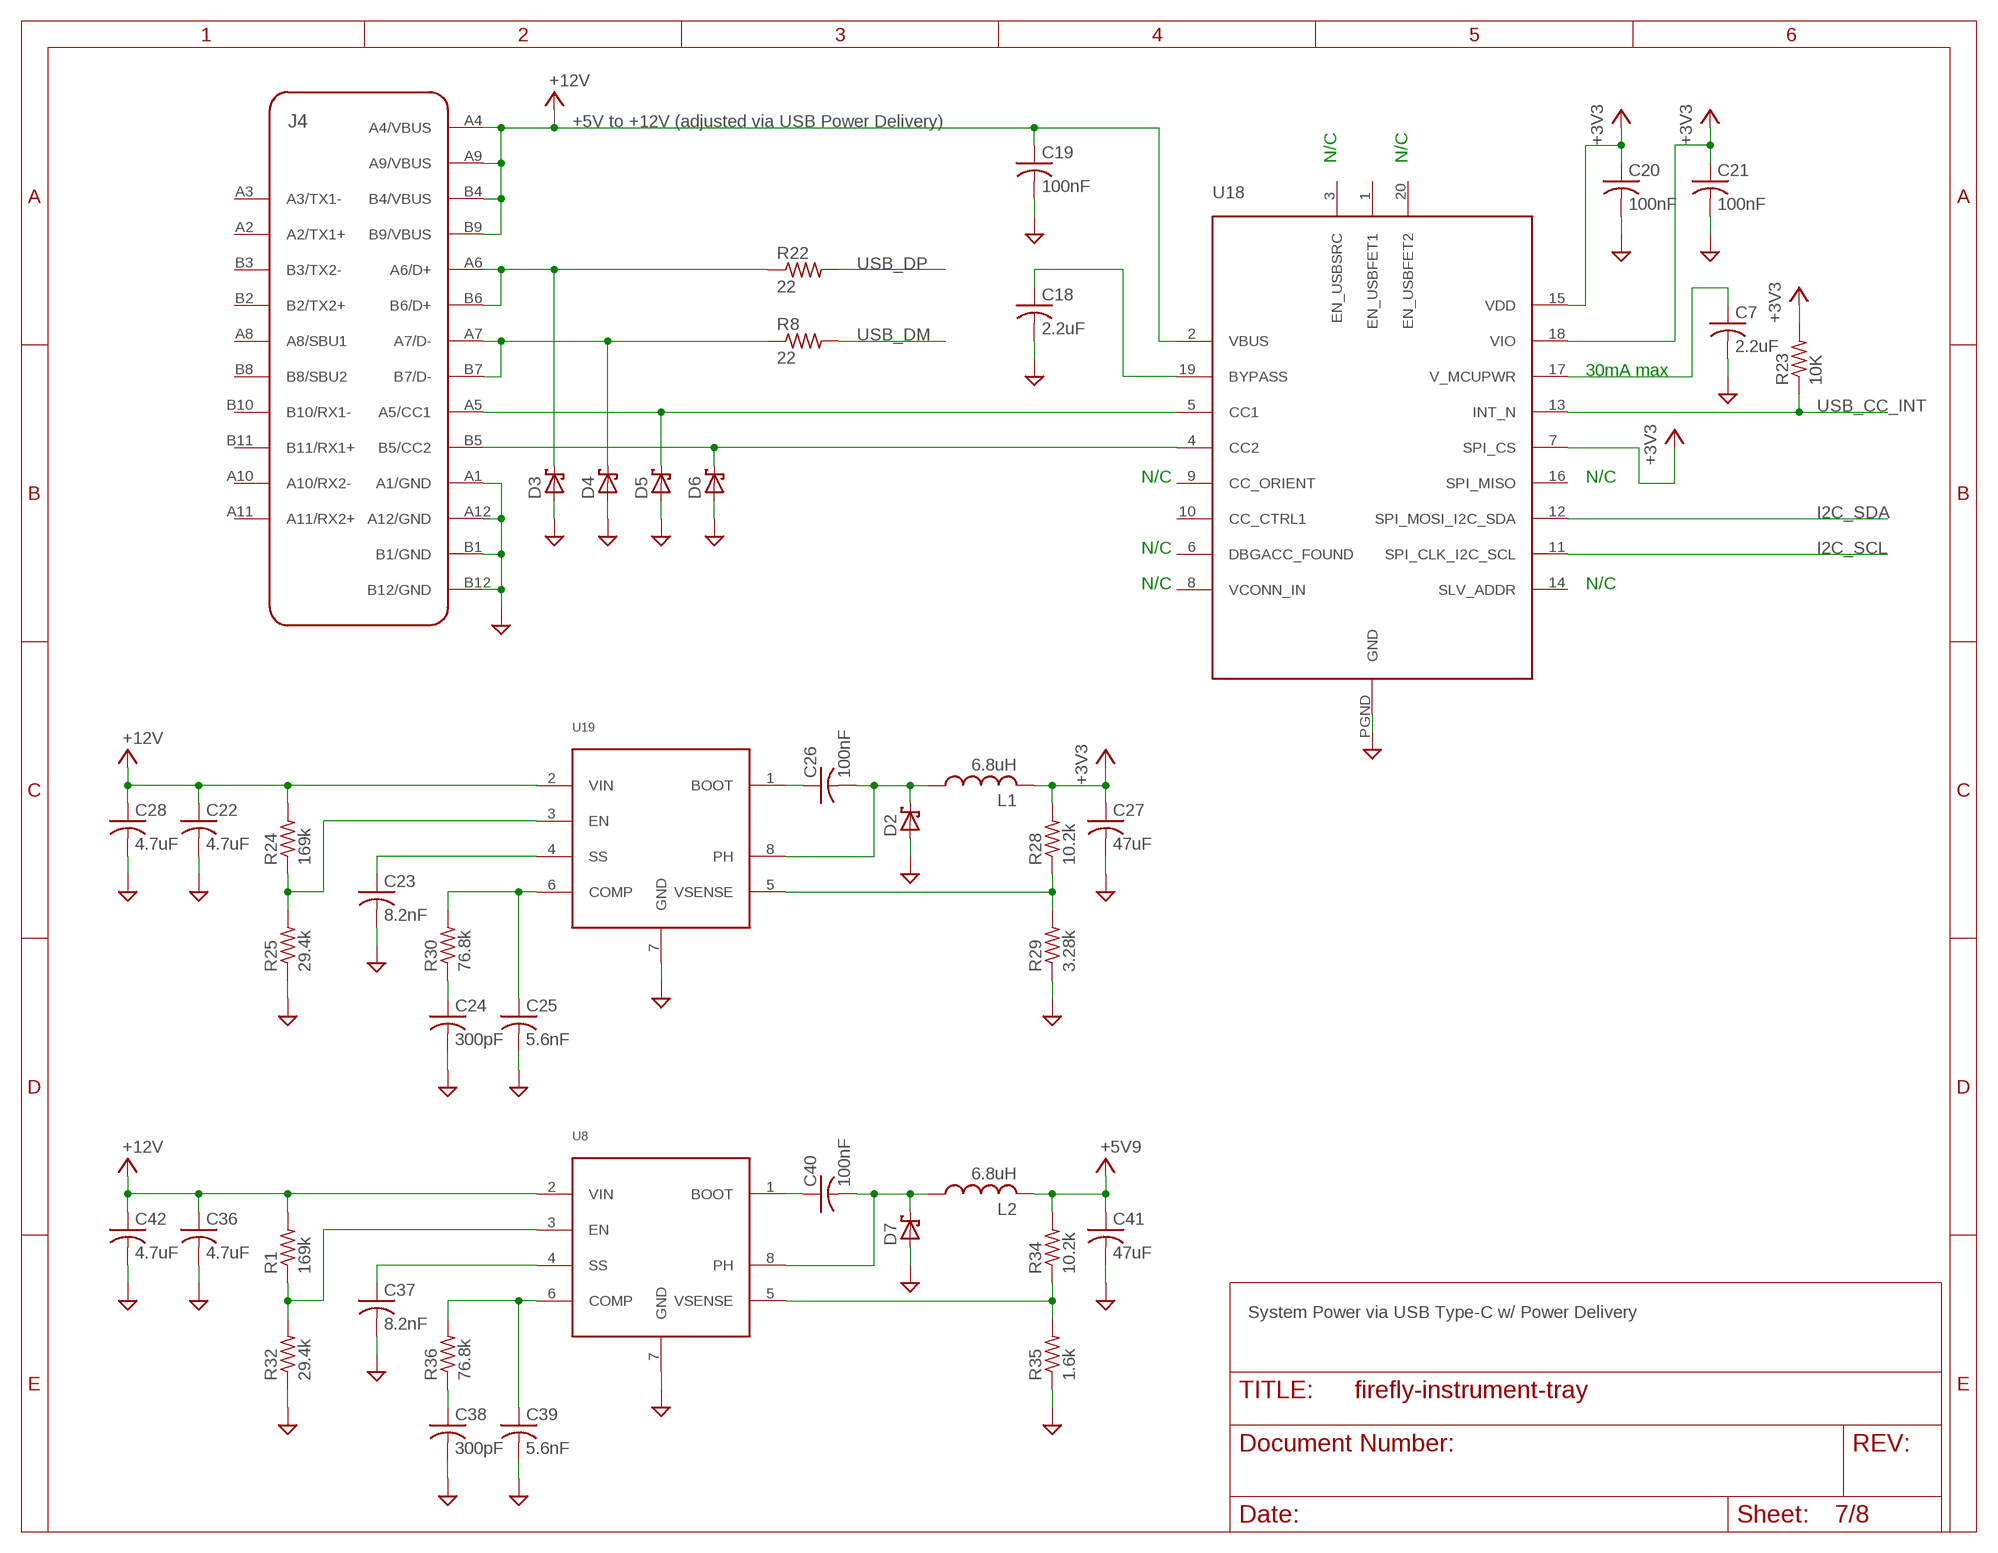
[diagram p6: schematic, sheet 7]

### Parts
C7  2.2uF  C-USC0805  [C0805]
C18  2.2uF  C-USC0805  [C0805]
C19  100nF  C-USC0805  [C0805]
C20  100nF  C-USC0805  [C0805]
C21  100nF  C-USC0805  [C0805]
C22  4.7uF  C-USC1210  [C1210]
C23  8.2nF  C-USC0805  [C0805]
C24  300pF  C-USC0805  [C0805]
C25  5.6nF  C-USC0805  [C0805]
C26  100nF  C-USC0805  [C0805]
C27  47uF  C-USC1206  [C1206]
C28  4.7uF  C-USC1210  [C1210]
C36  4.7uF  C-USC1210  [C1210]
C37  8.2nF  C-USC0805  [C0805]
C38  300pF  C-USC0805  [C0805]
C39  5.6nF  C-USC0805  [C0805]
C40  100nF  C-USC0805  [C0805]
C41  47uF  C-USC1206  [C1206]
C42  4.7uF  C-USC1210  [C1210]
D2  D-USDO-214AB  [DO-214AB]
D3  D-USSMM4FXXA  [SMM4FXXA]
D4  D-USSMM4FXXA  [SMM4FXXA]
D5  D-USSMM4FXXA  [SMM4FXXA]
D6  D-USSMM4FXXA  [SMM4FXXA]
D7  D-USDO-214AB  [DO-214AB]
J4  USB-CAUSB1-DFN-PTR3  [AUSB1-DFN-PTR3]
L1  6.8uH  INDUCTORSDR0805  [SDR0805]
L2  6.8uH  INDUCTORSDR0805  [SDR0805]
R1  169k  R-USR0805  [R0805]
R8  22  R-USR0805  [R0805]
R22  22  R-USR0805  [R0805]
R23  10K  R-USR0805  [R0805]
R24  169k  R-USR0805  [R0805]
R25  29.4k  R-USR0805  [R0805]
R28  10.2k  R-USR0805  [R0805]
R29  3.28k  R-USR0805  [R0805]
R30  76.8k  R-USR0805  [R0805]
R32  29.4k  R-USR0805  [R0805]
R34  10.2k  R-USR0805  [R0805]
R35  1.6k  R-USR0805  [R0805]
R36  76.8k  R-USR0805  [R0805]
U8  TPS54232  [R-PDSO-G8]
U18  PTN5100  [HVQFN20]
U19  TPS54232  [R-PDSO-G8]

### Nets
+3V3: C20.1 C21.1 C27.1 L1.2 R23.2 R28.2 U18.7(SPI_CS) U18.15(VDD) U18.18(VIO) ; also sheet 2,3,4,5,6,8
+5V9: C41.1 L2.2 R34.2 ; also sheet 3,4
+12V: C22.1 C28.1 C36.1 C42.1 R1.2 R24.2 U8.2(VIN) U19.2(VIN) ; also sheet 6,8
GND: C7.2 C18.2 C19.2 C20.2 C21.2 C22.2 C23.2 C24.2 C25.2 C27.2 C28.2 C36.2 C37.2 C38.2 C39.2 C41.2 C42.2 D2.A D3.A D4.A D5.A D6.A D7.A J4.A1(A1/GND) J4.A12(A12/GND) J4.B1(B1/GND) J4.B12(B12/GND) R25.1 R29.1 R32.1 R35.1 U8.7(GND) U18.PGND(GND) U19.7(GND) ; also sheet 1,2,3,4,5,6,8
I2C_SCL: U18.11(SPI_CLK_I2C_SCL) ; also sheet 2,3,4,5
I2C_SDA: U18.12(SPI_MOSI_I2C_SDA) ; also sheet 2,3,4,5
N$2: C40.1 U8.1(BOOT)
N$3: C40.2 D7.C L2.1 U8.8(PH)
N$4: C19.1 J4.A4(A4/VBUS) J4.A9(A9/VBUS) J4.B4(B4/VBUS) J4.B9(B9/VBUS) U18.2(VBUS)
N$18: D3.C J4.A6(A6/D+) J4.B6(B6/D+) R22.1
N$19: D4.C J4.A7(A7/D-) J4.B7(B7/D-) R8.1
N$20: D5.C J4.A5(A5/CC1) U18.5(CC1)
N$21: D6.C J4.B5(B5/CC2) U18.4(CC2)
N$23: C18.1 U18.19(BYPASS)
N$27: C7.1 U18.17(V_MCUPWR)
N$28: C26.1 U19.1(BOOT)
N$29: C26.2 D2.C L1.1 U19.8(PH)
N$31: R28.1 R29.2 U19.5(VSENSE)
N$32: C25.1 R30.2 U19.6(COMP)
N$33: C24.1 R30.1
N$34: C23.1 U19.4(SS)
N$35: R24.1 R25.2 U19.3(EN)
N$39: R34.1 R35.2 U8.5(VSENSE)
N$40: C39.1 R36.2 U8.6(COMP)
N$41: C38.1 R36.1
N$42: C37.1 U8.4(SS)
N$43: R1.1 R32.2 U8.3(EN)
USB_CC_INT: R23.1 U18.13(INT_N) ; also sheet 5
USB_DM: R8.2 ; also sheet 5,8
USB_DP: R22.2 ; also sheet 5,8
Unconnected: J4.A2(A2/TX1+) J4.A3(A3/TX1-) J4.A8(A8/SBU1) J4.A10(A10/RX2-) J4.A11(A11/RX2+) J4.B2(B2/TX2+) J4.B3(B3/TX2-) J4.B8(B8/SBU2) J4.B10(B10/RX1-) J4.B11(B11/RX1+) U18.1(EN_USBFET1) U18.3(EN_USBSRC) U18.6(DBGACC_FOUND) U18.8(VCONN_IN) U18.9(CC_ORIENT) U18.10(CC_CTRL1) U18.14(SLV_ADDR) U18.16(SPI_MISO) U18.20(EN_USBFET2)

### Notes on the sheet
- +5V to +12V (adjusted via USB Power Delivery)
- N/C | N/C
- 30mA max
- N/C | N/C
- N/C
- N/C | N/C
- System Power via USB Type-C w/ Power Delivery

## Sheet 8 of 8
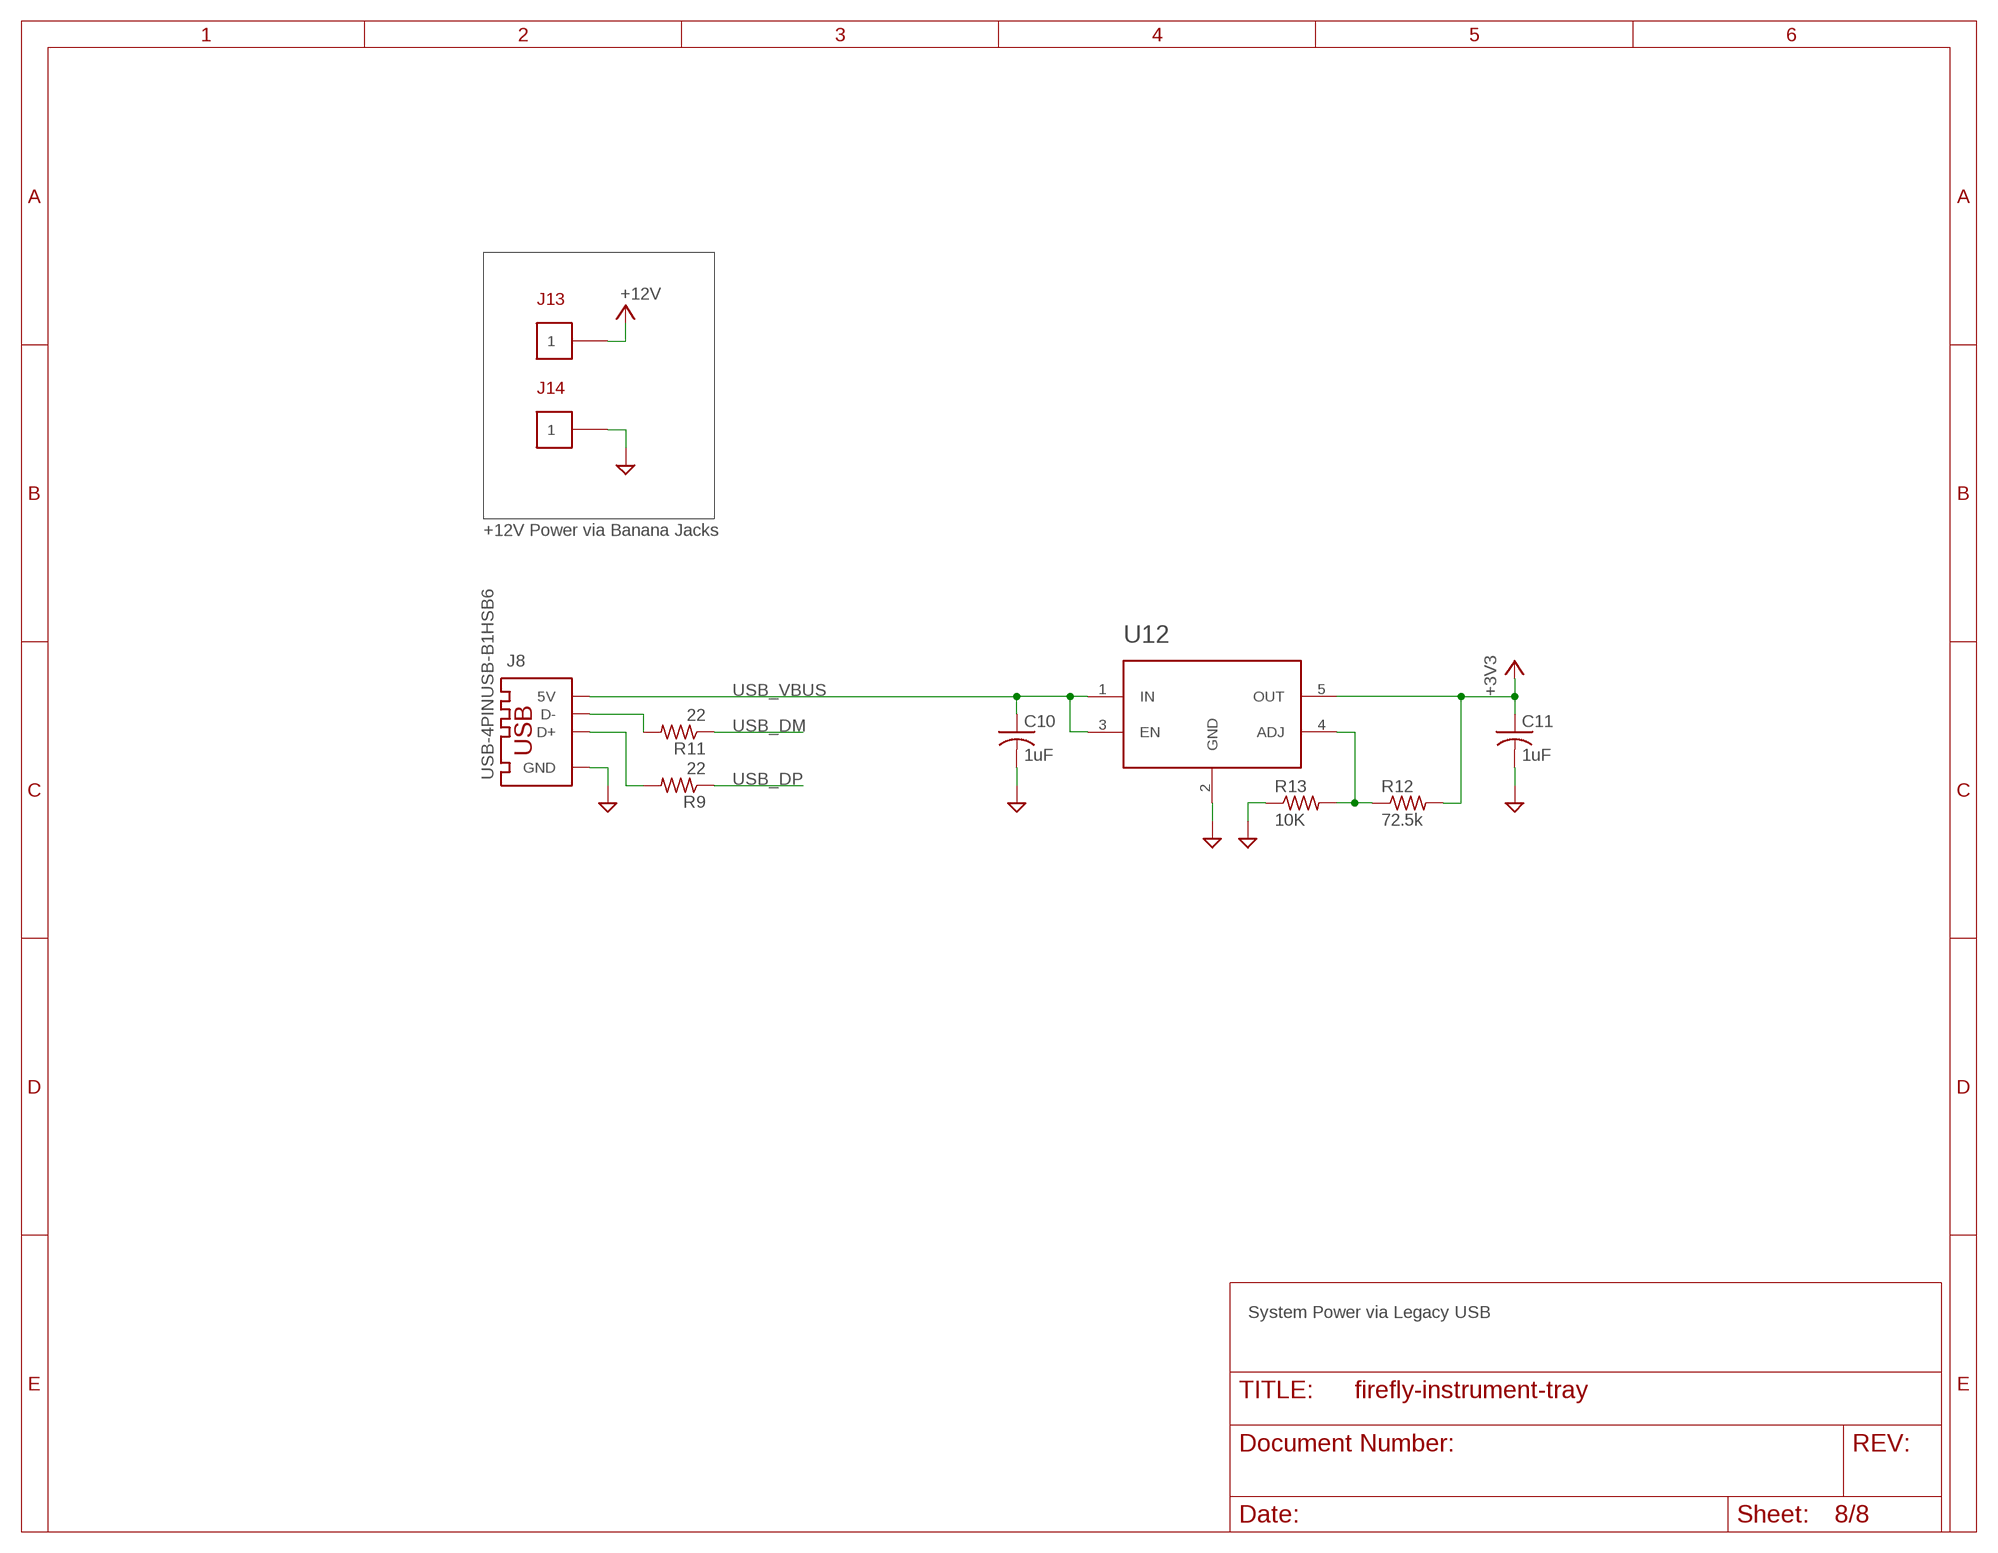
[diagram p7: schematic, sheet 8]

### Parts
C10  1uF  C-USC0805  [C0805]
C11  1uF  C-USC0805  [C0805]
J8  USB-4PINUSB-B1HSB6  [USB-B1HSB6]
J13  CON-1CT3151  [CT3151]
J14  CON-1CT3151  [CT3151]
R9  22  R-USR0805  [R0805]
R11  22  R-USR0805  [R0805]
R12  72.5k  R-USR0805  [R0805]
R13  10K  R-USR0805  [R0805]
U12  VREG-ADJAP7331-WG-7  [SOT-23-5]

### Nets
+3V3: C11.1 R12.2 U12.5(OUT) ; also sheet 2,3,4,5,6,7
+12V: J13.1 J13.2 J13.3 J13.4 ; also sheet 6,7
GND: C10.2 C11.2 J8.4(GND) J14.1 J14.2 J14.3 J14.4 R13.1 U12.2(GND) ; also sheet 1,2,3,4,5,6,7
N$11: R12.1 R13.2 U12.4(ADJ)
N$12: J8.2(D-) R11.2
N$14: J8.3(D+) R9.2
USB_DM: R11.1 ; also sheet 5,7
USB_DP: R9.1 ; also sheet 5,7
USB_VBUS: C10.1 J8.1(5V) U12.1(IN) U12.3(EN) ; also sheet 5

### Notes on the sheet
- +12V Power via Banana Jacks
- System Power via Legacy USB

## Library data of the parts
C1-C3 C12 C13 C15 C17 C19-C21 C26 C31 C32 C40 C43 C45 C47 = firefly:C-US: CAPACITOR, American symbol; MANUFACTURER: AVX Corporation; ORDERING-CODE: 08055C104KAT2A
C4 C10 C11 = firefly:C-US: CAPACITOR, American symbol; MANUFACTURER: Yageo; ORDERING-CODE: CC0805KKX7R7BB105
C5 C6 = firefly:C-US: CAPACITOR, American symbol; MANUFACTURER: Samsung Electro-Mechanics America, Inc.; ORDERING-CODE: CL21C220FBANNNC
C7 C18 C29 C30 C34 C35 C49 = firefly:C-US: CAPACITOR, American symbol
C8 = firefly:C-US: CAPACITOR, American symbol; MANUFACTURER: Murata Electronics North America; ORDERING-CODE: GRM21BR61E475KA12L
C9 = firefly:C-US: CAPACITOR, American symbol; MANUFACTURER: AVX Corporation; ORDERING-CODE: 08055C103KAT2A
C14 C33 C44 C46 C48 = firefly:C-US: CAPACITOR, American symbol; MANUFACTURER: AVX Corporation; ORDERING-CODE: 0805YD106KAT2A
C16 = firefly:C-US: CAPACITOR, American symbol; MANUFACTURER: Eaton; ORDERING-CODE: PM-5R0V105-R
C22 C28 C36 C42 = firefly:C-US: CAPACITOR, American symbol; MANUFACTURER: Murata Electronics North America; ORDERING-CODE: GRM32ER71H475KA88L
C23 C37 = firefly:C-US: CAPACITOR, American symbol; MANUFACTURER: Murata Electronics North America; ORDERING-CODE: GRM21BR72A822KA01L
C24 C38 = firefly:C-US: CAPACITOR, American symbol; MANUFACTURER: Samsung Electro-Mechanics America, Inc.; ORDERING-CODE: CL21B301KBANNNC
C25 C39 = firefly:C-US: CAPACITOR, American symbol; MANUFACTURER: Yageo; ORDERING-CODE: CC0805KRX7R9BB562
C27 C41 = firefly:C-US: CAPACITOR, American symbol; MANUFACTURER: Murata Electronics North America; ORDERING-CODE: GRM31CC80J476KE18L
C50 = firefly:C-US: CAPACITOR, American symbol; MANUFACTURER: Samsung Electro-Mechanics America, Inc.; ORDERING-CODE: CL21B105KAFNNNG
D1 = firefly:LED-RGB-CA; MANUFACTURER: Rohm Semiconductor; ORDERING-CODE: MSL0201RGBW1
D2 D7 = firefly:D-US; MANUFACTURER: Vishay Semiconductor Diodes Division; ORDERING-CODE: SL44-E3/57T
D3-D6 = firefly:D-US; MANUFACTURER: STMicroelectronics; ORDERING-CODE: SMM4F24A-TR
J1 = firefly:CON-26; MANUFACTURER: Amphenol FCI; ORDERING-CODE: 68602-126HLF
J3 = firefly:CON-4; MANUFACTURER: TE Connectivity AMP Connectors; ORDERING-CODE: 282847-4
J4 = firefly:USB-C; MANUFACTURER: Assmann WSW Components; ORDERING-CODE: AUSB1-DFN-PTR3
J8 = firefly:USB-4PIN; MANUFACTURER: On Shore Technology Inc.; ORDERING-CODE: USB-B1HSB6
J9 = firefly:CON-10; MAUFACTURER: Harwin; ORDERING-CODE: M50-3500542
J13 = firefly:CON-1; MANUFACTURER: B&K Precision; ORDERING-CODE: CT3151-2
J14 = firefly:CON-1; MANUFACTURER: B&K Precision; ORDERING-CODE: CT3151-0
L1 L2 = firefly:INDUCTOR; MANUFACTURER: Bourns Inc.; ORDERING-CODE: SDR0805-6R8ML
R1 R24 = firefly:R-US: RESISTOR, American symbol; MANUFACTURER: Yageo; ORDERING-CODE: RC0805FR-07169KL
R2 = firefly:R-US: RESISTOR, American symbol; MANUFACTURER: Ohmite; ORDERING-CODE: RW0S6BB100RFET
R7 R13 R23 = firefly:R-US: RESISTOR, American symbol; MANUFACTURER: Yageo; ORDERING-CODE: RC0805FR-0710KL
R8 R9 R11 R22 = firefly:R-US: RESISTOR, American symbol; MANUFACTURER: Yageo; ORDERING-CODE: RC0805FR-0722RL
R10 R16 = firefly:R-US: RESISTOR, American symbol; MANUFACTURER: Yageo; ORDERING-CODE: RC0805FR-0760R4L
R12 = firefly:R-US: RESISTOR, American symbol; MANUFACTURER: Yageo; ORDERING-CODE: RT0805BRD0773K2L
R14 R15 = firefly:R-US: RESISTOR, American symbol; MANUFACTURER: Yageo; ORDERING-CODE: RC0805FR-074K7L
R17 = firefly:R-US: RESISTOR, American symbol; MANUFACTURER: Yageo; ORDERING-CODE: RC0805FR-07240RL
R18 = firefly:R-US: RESISTOR, American symbol; MANUFACTURER: Vishay Dale; ORDERING-CODE: RCL12251R00FKEG
R19 = firefly:R-US: RESISTOR, American symbol; MANUFACTURER: Yageo; ORDERING-CODE: RC0805FR-070RL
R20 R21 = firefly:R-US: RESISTOR, American symbol; MANUFACTURER: Vishay Dale; ORDERING-CODE: RCL122549R9FKEG
R25 R32 = firefly:R-US: RESISTOR, American symbol; MANUFACTURER: Yageo; ORDERING-CODE: RC0805FR-0729K4L
R26 R31 = firefly:R-US: RESISTOR, American symbol; MANUFACTURER: Yageo; ORDERING-CODE: RC0805FR-0743RL
R27 R33 = firefly:R-US: RESISTOR, American symbol; MANUFACTURER: Yageo; ORDERING-CODE: RC0805FR-071RL
R28 R34 R37 = firefly:R-US: RESISTOR, American symbol; MANUFACTURER: Yageo; ORDERING-CODE: RT0805DRE0710K2L
R29 = firefly:R-US: RESISTOR, American symbol; MANUFACTURER: Yageo; ORDERING-CODE: RT0805BRD073K28L
R30 R36 = firefly:R-US: RESISTOR, American symbol; MANUFACTURER: Yageo; ORDERING-CODE: RC0805FR-0776K8L
R35 = firefly:R-US: RESISTOR, American symbol; MANUFACTURER: Yageo; ORDERING-CODE: RT0805BRD071K6L
R38 = firefly:R-US: RESISTOR, American symbol; MANUFACTURER: Yageo; ORDERING-CODE: RT0805DRE071K47L
U8 U19 = firefly:TPS54232; MANUFACTURER: Texas Instruments; ORDERING-CODE: TPS54232DR
U12 U25 = firefly:VREG-ADJ
U13 = firefly:MCP47X6; MANUFACTURER: Microchip Technology; ORDERING-CODE: MCP4726A1T-E/CH
U14 = firefly:STM32F411-LQFP64; MANUFACTURER: STMicroelectronics; ORDERING-CODE: STM32F411RET6
U17 = firefly:MEMORY-SPI; MANUFACTURER: Adesto Technologies; ORDERING-CODE: AT25SF161-SSHD-T
U18 = firefly:PTN5100; MANUFACTURER: NXP USA Inc.; ORDERING-CODE: PTN5100ABS
U20 = firefly:MCP1501; MANUFACTURER: Microchip Technology; ORDERING-CODE: MCP1501T-10E/CHY
U21 = firefly:MCP47X6; MANUFACTURER: Microchip Technology; ORDERING-CODE: MCP4726A0T-E/CH
U22 = firefly:MCP1501; MANUFACTURER: Microchip Technology; ORDERING-CODE: MCP1501T-18E/CHY
U24 = firefly:AD7327
X1 = firefly:XTAL2; MANUFACTURER: TXC CORPORATION; ORDERING-CODE: 7A-8.000MAAE-T

## Module RELAY
Ports: ANO(io) AC(io) ANC(io) BNO(io) BC(io) BNC(io) EN(io) +3V3(pwr) GND(pwr)
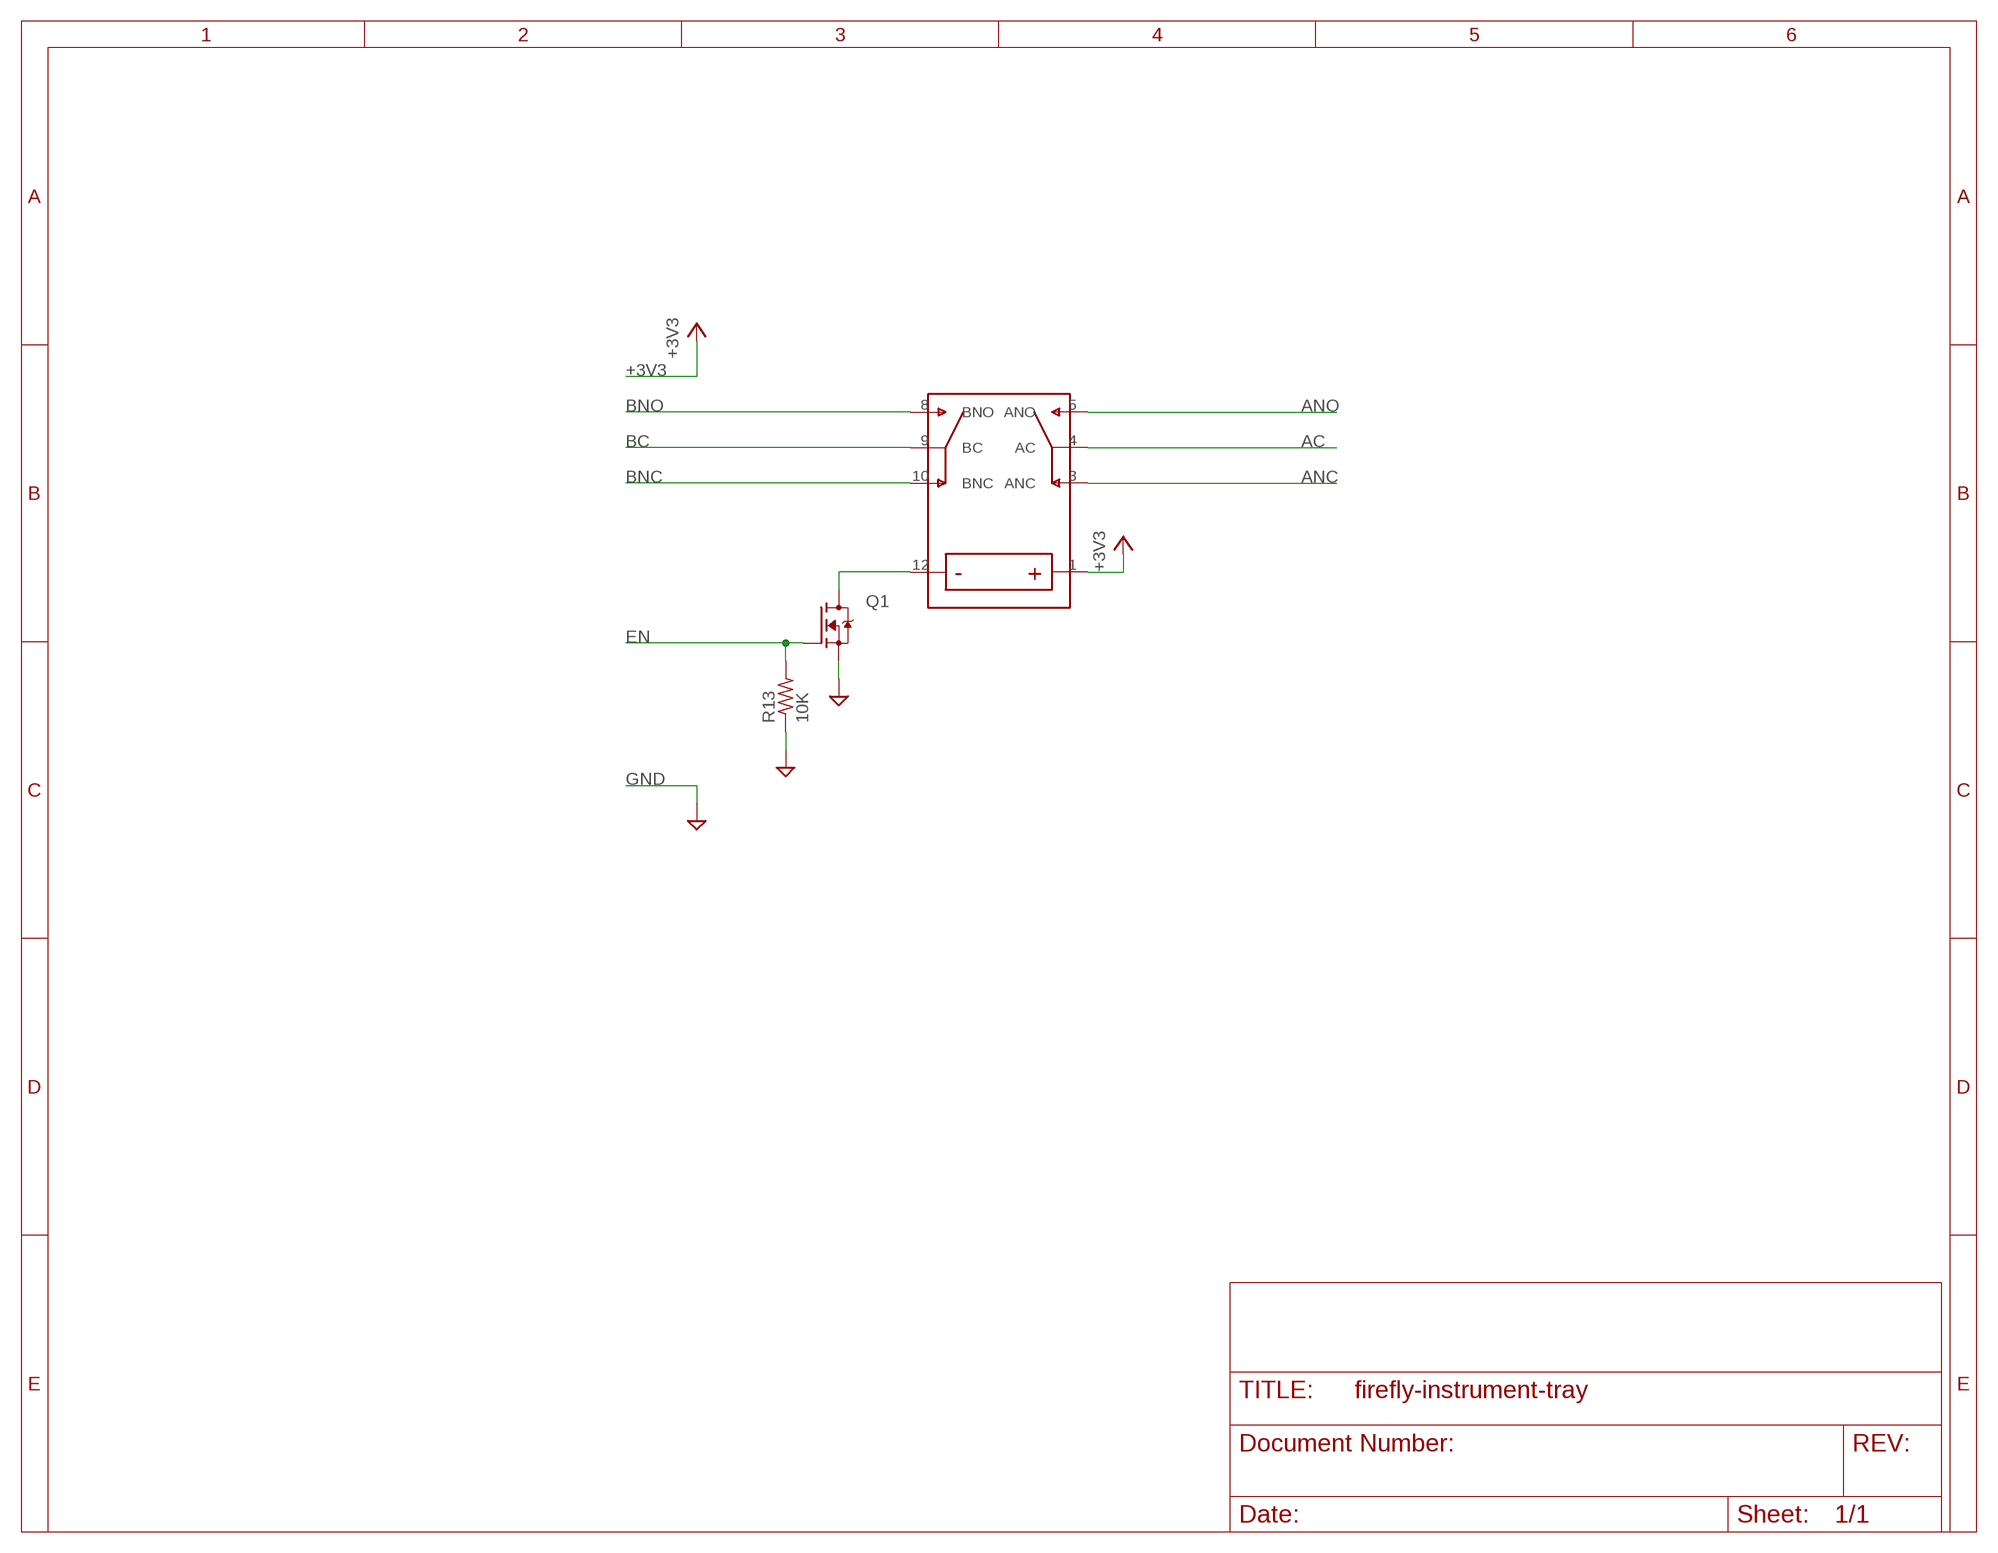
[diagram p8: schematic, module RELAY, sheet 1]

### Parts
Q1  FET-NMCPH3  [MCPH3]
R13  10K  R-USR0805  [R0805]
U1  TXS2SA  [TXS2SA]

### Nets
+3V3: U1.1(+)
AC: U1.4(AC)
ANC: U1.3(ANC)
ANO: U1.5(ANO)
BC: U1.9(BC)
BNC: U1.10(BNC)
BNO: U1.8(BNO)
EN: Q1.1(G) R13.2
GND: Q1.2(S) R13.1
N$2: Q1.3(D) U1.12(-)

### Library data of the parts
Q1 = firefly:FET-N; MANUFACURER: ON Semiconductor; ORDERING-CODE: MCH3481-TL-W
R13 = firefly:R-US: RESISTOR, American symbol; MANUFACTURER: Yageo; ORDERING-CODE: RC0805FR-0710KL
U1 = firefly:TXS2SA; MANUFACTURER: Panasonic Electric Works; ORDERING-CODE: TXS2SA-3V-Z

## Module CURRENT_SENSE
Ports: GND(io) VCC(io) R(io) S(io) EN(io) SENSE(io)
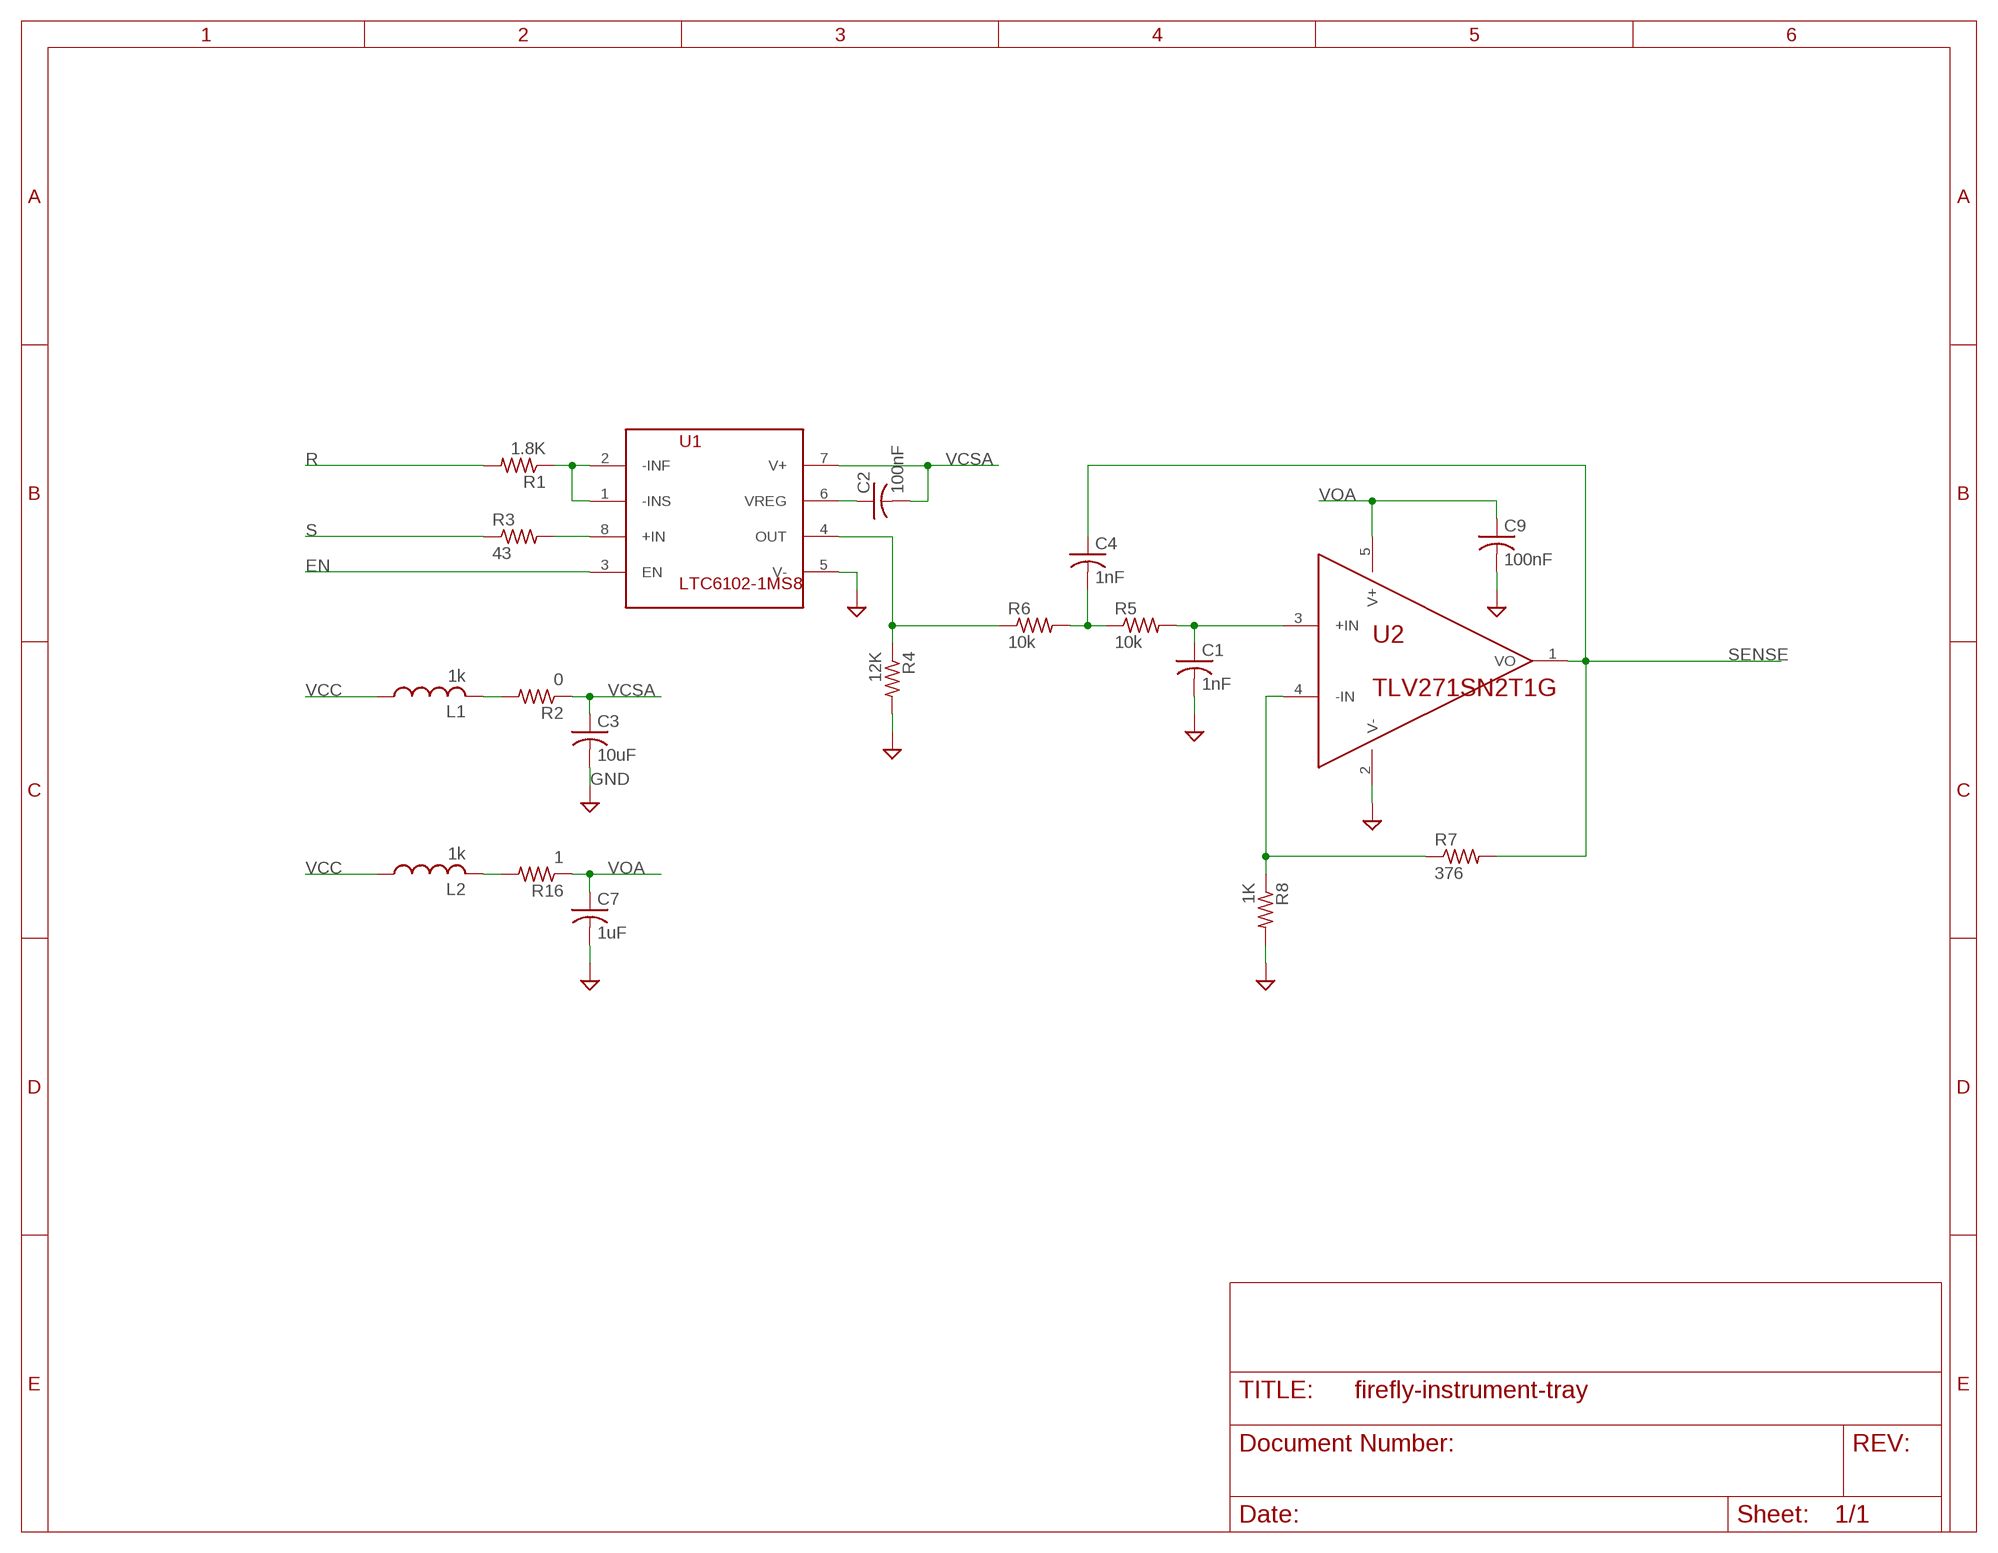
[diagram p9: schematic, module CURRENT_SENSE, sheet 1]

### Parts
C1  1nF  C-USC0805  [C0805]
C2  100nF  C-USC0805  [C0805]
C3  10uF  C-USC0805  [C0805]
C4  1nF  C-USC0805  [C0805]
C7  1uF  C-USC0805  [C0805]
C9  100nF  C-USC0805  [C0805]
L1  1k  L-USL2012C  [L2012C]
L2  1k  L-USL2012C  [L2012C]
R1  1.8K  R-USR0805  [R0805]
R2  0  R-USR0805  [R0805]
R3  43  R-USR0805  [R0805]
R4  12K  R-USR0805  [R0805]
R5  10k  R-USR0805  [R0805]
R6  10k  R-USR0805  [R0805]
R7  376  R-USR0805  [R0805]
R8  1K  R-USR0805  [R0805]
R16  1  R-USR0805  [R0805]
U1  LTC6102-1MS8  [MSOP8]
U2  TLV271SN2T1G  [SOT-23-5]

### Nets
EN: U1.3(EN)
GND: C1.2 C3.2 C7.2 C9.2 R4.2 R8.2 U1.5(V-) U2.2(V-)
N$1: L1.2 R2.2
N$2: L2.2 R16.2
N$3: C2.1 U1.6(VREG)
N$4: R1.1 U1.1(-INS) U1.2(-INF)
N$7: R3.2 U1.8(+IN)
N$9: R4.1 R6.1 U1.4(OUT)
N$10: C4.2 R5.1 R6.2
N$11: C1.1 R5.2 U2.3(+IN)
N$12: R7.1 R8.1 U2.4(-IN)
R: R1.2
S: R3.1
SENSE: C4.1 R7.2 U2.1(VO)
VCC: L1.1 L2.1
VCSA: C2.2 C3.1 R2.1 U1.7(V+)
VOA: C7.1 C9.1 R16.1 U2.5(V+)

### Library data of the parts
C1 = firefly:C-US: CAPACITOR, American symbol; ORDERING-CODE: 08055A102JAT2A
C2 C9 = firefly:C-US: CAPACITOR, American symbol; MANUFACTURER: AVX Corporation; ORDERING-CODE: 08055C104KAT2A
C3 = firefly:C-US: CAPACITOR, American symbol; MANUFACTURER: AVX Corporation; ORDERING-CODE: 0805YD106KAT2A
C4 = firefly:C-US: CAPACITOR, American symbol; MANUFACTURER: AVX Corporation; ORDERING-CODE: 08055A102JAT2A
C7 = firefly:C-US: CAPACITOR, American symbol; MANUFACTURER: Yageo; ORDERING-CODE: CC0805KKX7R7BB105
L1 L2 = firefly:L-US: INDUCTOR, American symbol; MANUFACTURER: Murata Electronics; ORDERING-CODE: BLM21BD102SN1D
R1 = firefly:R-US: RESISTOR, American symbol; MANUFACTURER: Yageo; ORDERING-CODE: RC0805FR-071K8L
R2 = firefly:R-US: RESISTOR, American symbol; MANUFACTURER: Yageo; ORDERING-CODE: RC0805FR-070RL
R3 = firefly:R-US: RESISTOR, American symbol; MANUFACTURER: Yageo; ORDERING-CODE: RC0805FR-0743RL
R4 = firefly:R-US: RESISTOR, American symbol; MANUFACTURER: Yageo; ORDERING-CODE: RC0805FR-0712KL
R5 R6 = firefly:R-US: RESISTOR, American symbol; MANUFACTURER: Yageo; ORDERING-CODE: RC0805FR-0710KL
R7 = firefly:R-US: RESISTOR, American symbol; MANUFACTURER: Yageo; ORDERING-CODE: RC0805FR-07374RL
R8 = firefly:R-US: RESISTOR, American symbol; MANUFACTURER: Yageo; ORDERING-CODE: RC0805FR-071KL
R16 = firefly:R-US: RESISTOR, American symbol; MANUFACTURER: Yageo; ORDERING-CODE: RC0805FR-071RL
U1 = firefly:LTC6102-1; MANUFACTURER: Linear Technology; ORDERING-CODE: LTC6102CMS8-1#PBF
U2 = firefly:TLV271SN2T1G; MANUFACTURER: ON Semiconductor; ORDERING-CODE: TLV271SN2T1G

## Module POWER_SUPPLY
Ports: GND(io) ADJ(io) EN(io) BAT+(io) SENSE_HIGH_RANGE(io) SENSE_LOW_RANGE(io) VIN(pwr)

### Sheet 1 of 2
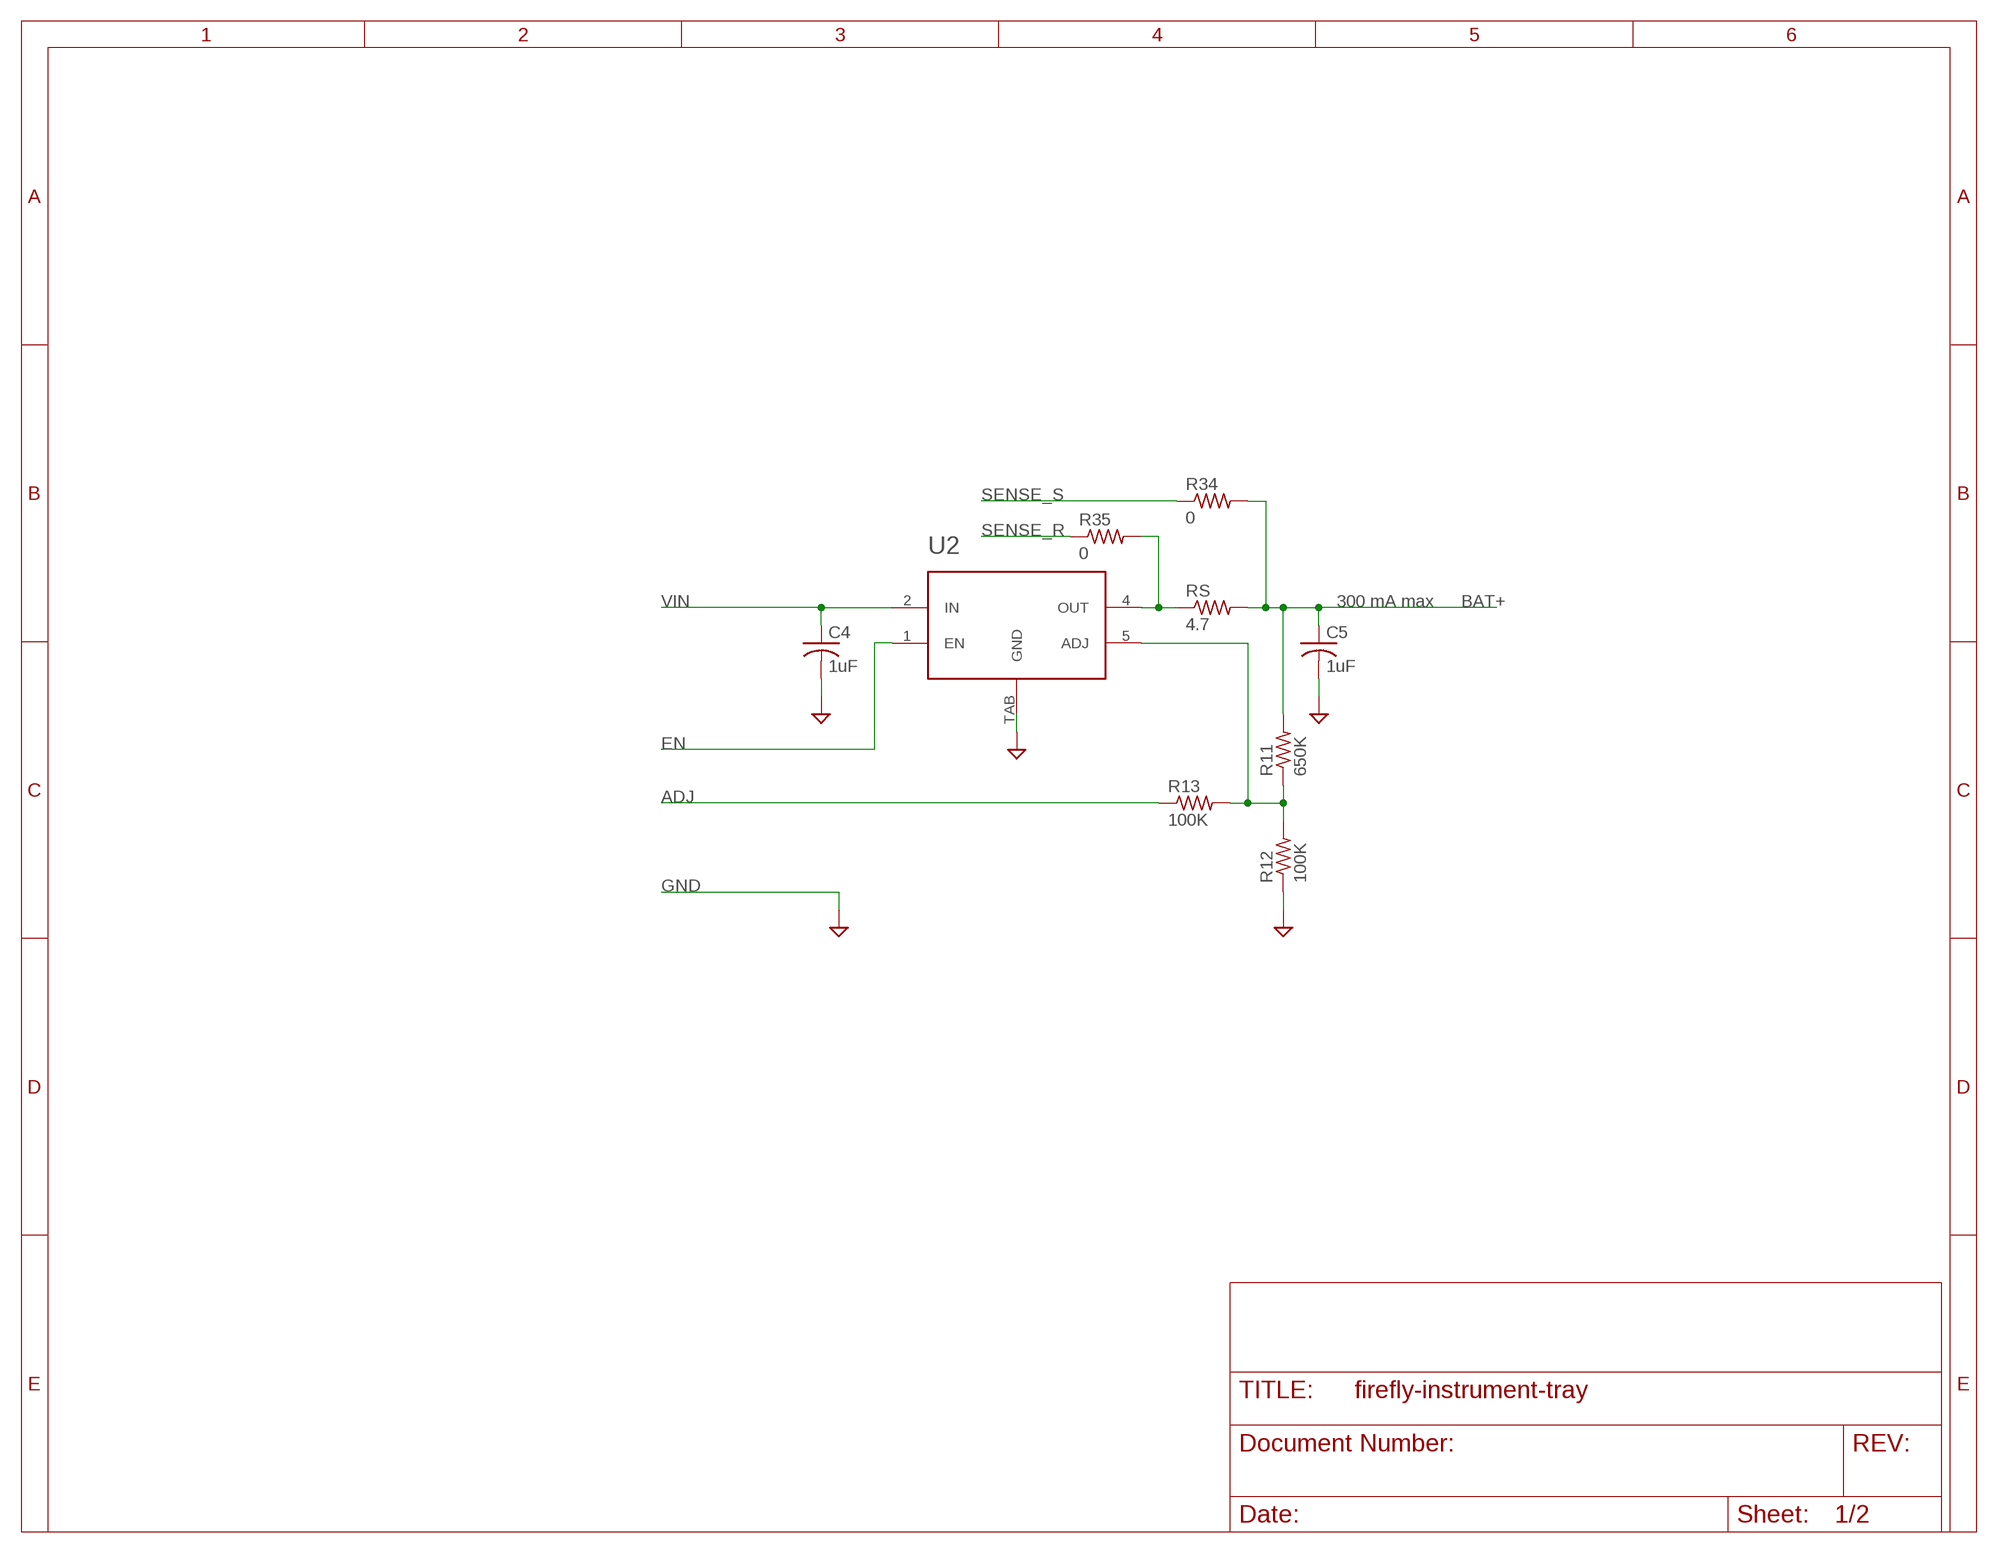
[diagram p10: schematic, module POWER_SUPPLY, sheet 1]

#### Parts
C4  1uF  C-USC0805  [C0805]
C5  1uF  C-USC0805  [C0805]
R11  650K  R-USR0805  [R0805]
R12  100K  R-USR0805  [R0805]
R13  100K  R-USR0805  [R0805]
R34  0  R-USR0805  [R0805]
R35  0  R-USR0805  [R0805]
RS  4.7  R-USR0805  [R0805]
U2  VREG-ADJLDFMPT-TR  [PPAK]

#### Nets
ADJ: R13.1
BAT+: C5.1 R11.2 R34.2 RS.2
EN: U2.1(EN) ; also sheet 2
GND: C4.2 C5.2 R12.1 U2.TAB(GND) ; also sheet 2
N$4: R11.1 R12.2 R13.2 U2.5(ADJ)
N$35: R35.2 RS.1 U2.4(OUT)
SENSE_R: R35.1 ; also sheet 2
SENSE_S: R34.1 ; also sheet 2
VIN: C4.1 U2.2(IN) ; also sheet 2

#### Notes on the sheet
- 300 mA max

### Sheet 2 of 2
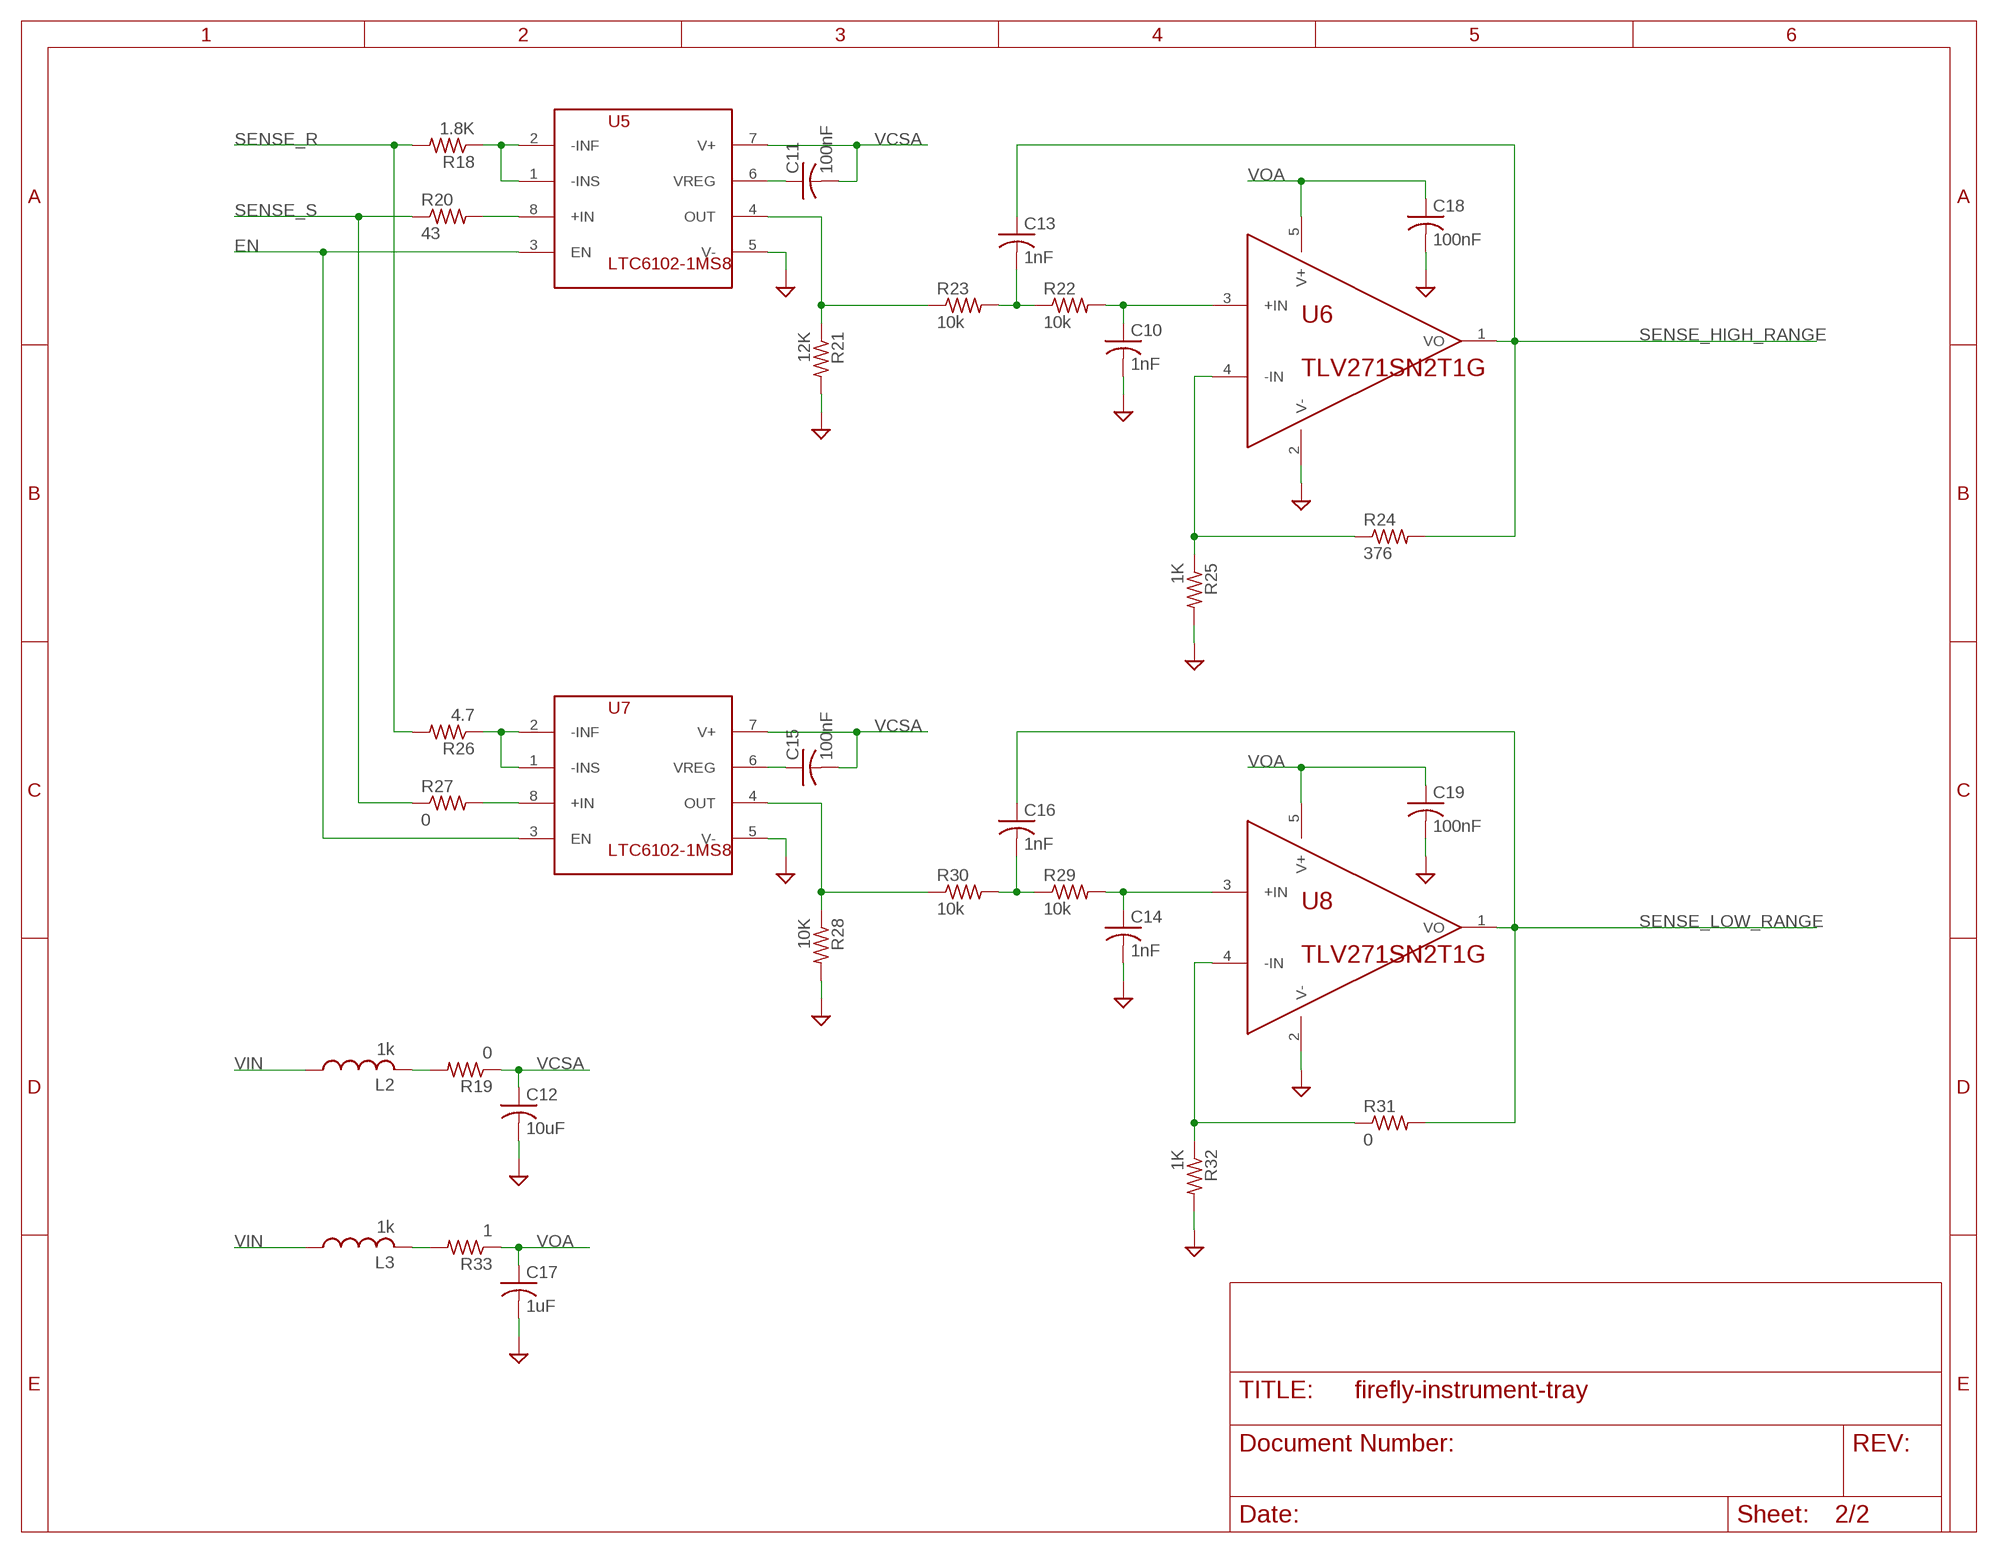
[diagram p11: schematic, module POWER_SUPPLY, sheet 2]

#### Parts
C10  1nF  C-USC0805  [C0805]
C11  100nF  C-USC0805  [C0805]
C12  10uF  C-USC0805  [C0805]
C13  1nF  C-USC0805  [C0805]
C14  1nF  C-USC0805  [C0805]
C15  100nF  C-USC0805  [C0805]
C16  1nF  C-USC0805  [C0805]
C17  1uF  C-USC0805  [C0805]
C18  100nF  C-USC0805  [C0805]
C19  100nF  C-USC0805  [C0805]
L2  1k  L-USL2012C  [L2012C]
L3  1k  L-USL2012C  [L2012C]
R18  1.8K  R-USR0805  [R0805]
R19  0  R-USR0805  [R0805]
R20  43  R-USR0805  [R0805]
R21  12K  R-USR0805  [R0805]
R22  10k  R-USR0805  [R0805]
R23  10k  R-USR0805  [R0805]
R24  376  R-USR0805  [R0805]
R25  1K  R-USR0805  [R0805]
R26  4.7  R-USR0805  [R0805]
R27  0  R-USR0805  [R0805]
R28  10K  R-USR0805  [R0805]
R29  10k  R-USR0805  [R0805]
R30  10k  R-USR0805  [R0805]
R31  0  R-USR0805  [R0805]
R32  1K  R-USR0805  [R0805]
R33  1  R-USR0805  [R0805]
U5  LTC6102-1MS8  [MSOP8]
U6  TLV271SN2T1G  [SOT-23-5]
U7  LTC6102-1MS8  [MSOP8]
U8  TLV271SN2T1G  [SOT-23-5]

#### Nets
EN: U5.3(EN) U7.3(EN) ; also sheet 1
GND: C10.2 C12.2 C14.2 C17.2 C18.2 C19.2 R21.2 R25.2 R28.2 R32.2 U5.5(V-) U6.2(V-) U7.5(V-) U8.2(V-) ; also sheet 1
N$13: L2.2 R19.2
N$14: C11.1 U5.6(VREG)
N$15: R18.1 U5.1(-INS) U5.2(-INF)
N$16: R20.2 U5.8(+IN)
N$17: R21.1 R23.1 U5.4(OUT)
N$18: C13.2 R22.1 R23.2
N$19: C10.1 R22.2 U6.3(+IN)
N$20: R24.1 R25.1 U6.4(-IN)
N$21: C15.1 U7.6(VREG)
N$22: R26.1 U7.1(-INS) U7.2(-INF)
N$23: R27.2 U7.8(+IN)
N$24: R28.1 R30.1 U7.4(OUT)
N$25: C16.2 R29.1 R30.2
N$26: C14.1 R29.2 U8.3(+IN)
N$27: R31.1 R32.1 U8.4(-IN)
N$28: L3.2 R33.2
SENSE_HIGH_RANGE: C13.1 R24.2 U6.1(VO)
SENSE_LOW_RANGE: C16.1 R31.2 U8.1(VO)
SENSE_R: R18.2 R26.2 ; also sheet 1
SENSE_S: R20.1 R27.1 ; also sheet 1
VCSA: C11.2 C12.1 C15.2 R19.1 U5.7(V+) U7.7(V+)
VIN: L2.1 L3.1 ; also sheet 1
VOA: C17.1 C18.1 C19.1 R33.1 U6.5(V+) U8.5(V+)

### Library data of the parts
C4 C5 C17 = firefly:C-US: CAPACITOR, American symbol; MANUFACTURER: Yageo; ORDERING-CODE: CC0805KKX7R7BB105
C10 C13 C14 C16 = firefly:C-US: CAPACITOR, American symbol; ORDERING-CODE: 08055A102JAT2A
C11 C15 C18 C19 = firefly:C-US: CAPACITOR, American symbol; MANUFACTURER: AVX Corporation; ORDERING-CODE: 08055C104KAT2A
C12 = firefly:C-US: CAPACITOR, American symbol; MANUFACTURER: AVX Corporation; ORDERING-CODE: 0805YD106KAT2A
L2 L3 = firefly:L-US: INDUCTOR, American symbol; MANUFACTURER: Murata Electronics; ORDERING-CODE: BLM21BD102SN1D
R11 = firefly:R-US: RESISTOR, American symbol; MANUFACTURER: Yageo; ORDERING-CODE: RC0805FR-07649KL
R12 R13 = firefly:R-US: RESISTOR, American symbol; MANUFACTURER: Yageo; ORDERING-CODE: RC0805FR-07100KL
R18 = firefly:R-US: RESISTOR, American symbol; MANUFACTURER: Yageo; ORDERING-CODE: RC0805FR-071K8L
R19 R27 R31 R34 R35 = firefly:R-US: RESISTOR, American symbol; MANUFACTURER: Yageo; ORDERING-CODE: RC0805FR-070RL
R20 = firefly:R-US: RESISTOR, American symbol; MANUFACTURER: Yageo; ORDERING-CODE: RC0805FR-0743RL
R21 = firefly:R-US: RESISTOR, American symbol; MANUFACTURER: Yageo; ORDERING-CODE: RC0805FR-0712KL
R22 R23 R25 R28-R30 R32 = firefly:R-US: RESISTOR, American symbol; MANUFACTURER: Yageo; ORDERING-CODE: RC0805FR-0710KL
R24 = firefly:R-US: RESISTOR, American symbol; MANUFACTURER: Yageo; ORDERING-CODE: RC0805FR-07374RL
R26 RS = firefly:R-US: RESISTOR, American symbol; MANUFACTURER: Yageo; ORDERING-CODE: RC0805FR-074R7L
R33 = firefly:R-US: RESISTOR, American symbol; MANUFACTURER: Yageo; ORDERING-CODE: RC0805FR-071RL
U2 = firefly:VREG-ADJ; MANUFACTURER: STMicroelectronics; ORDERING-CODE: LDFMPT-TR
U5 U7 = firefly:LTC6102-1; MANUFACTURER: Linear Technology; ORDERING-CODE: LTC6102CMS8-1#PBF
U6 U8 = firefly:TLV271SN2T1G; MANUFACTURER: ON Semiconductor; ORDERING-CODE: TLV271SN2T1G

## Module COLOR_SENSOR
Ports: INT(io) SCL(io) SDA(io) GND(io) +3V3(io)
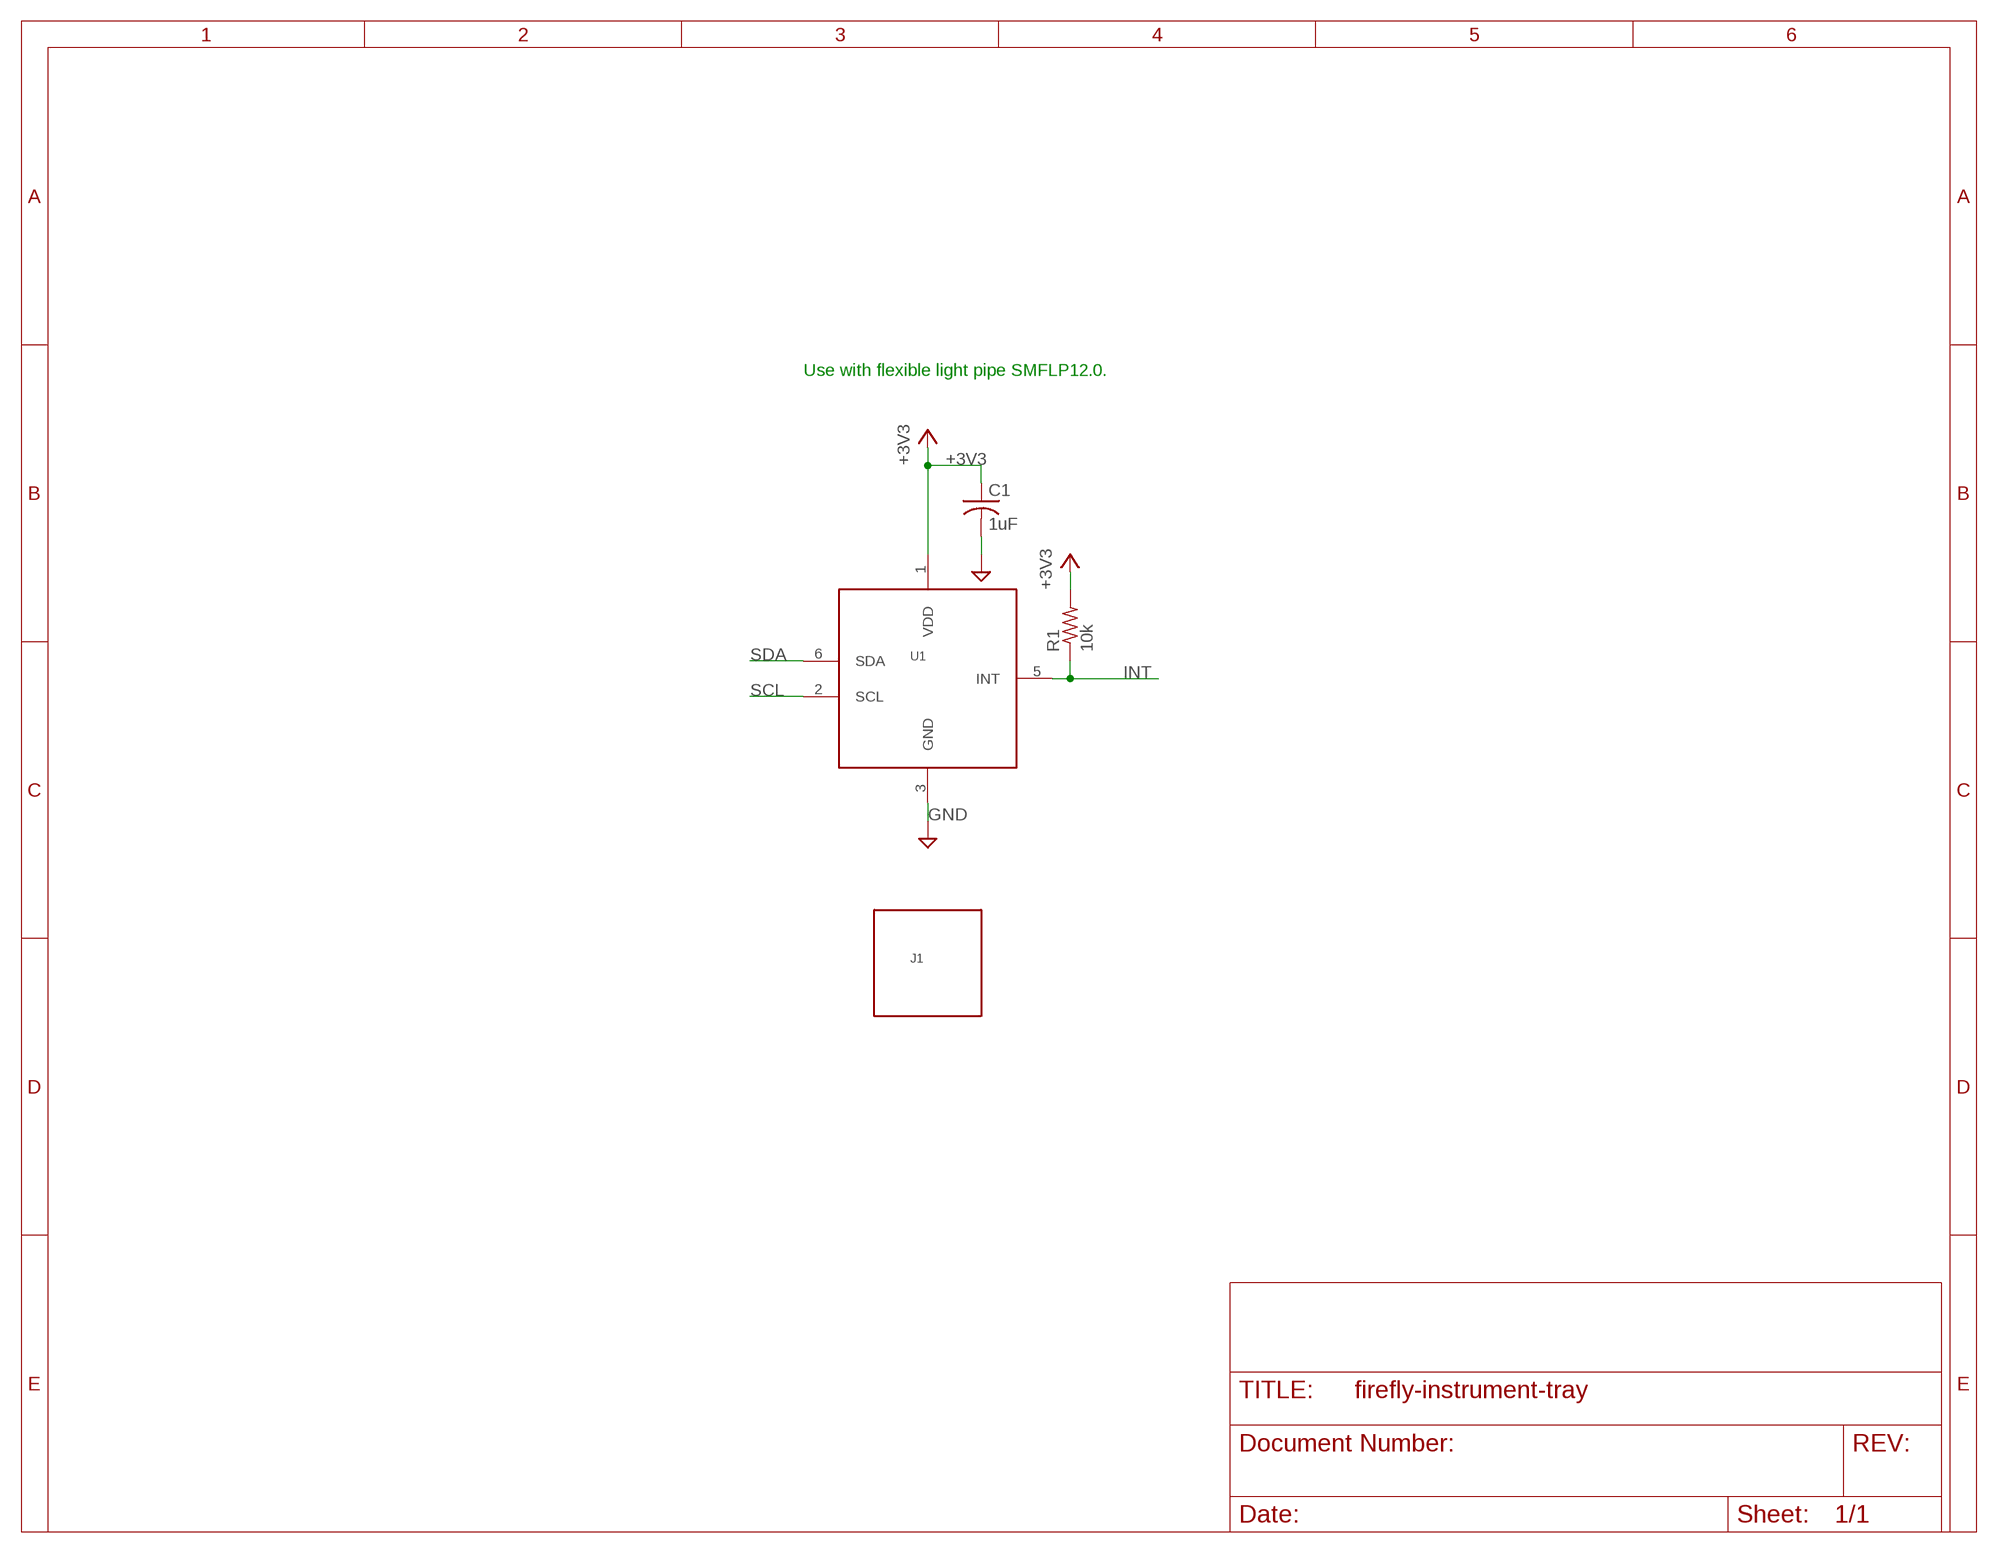
[diagram p12: schematic, module COLOR_SENSOR, sheet 1]

### Parts
C1  1uF  C-USC0805  [C0805]
J1  SMFLP  [SMFLP]
R1  10k  R-USR0805  [R0805]
U1  TCS3471  [DFN6]

### Nets
+3V3: C1.1 R1.2 U1.1(VDD)
GND: C1.2 U1.3(GND)
INT: R1.1 U1.5(INT)
SCL: U1.2(SCL)
SDA: U1.6(SDA)

### Notes on the sheet
- Use with flexible light pipe SMFLP12.0.

### Library data of the parts
C1 = firefly:C-US: CAPACITOR, American symbol; MANUFACTURER: Yageo; ORDERING-CODE: CC0805KKX7R7BB105
J1 = firefly:SMFLP; MANUFACTURER: Bivar Inc.; ORDERING-CODE: SMFLP12.0
R1 = firefly:R-US: RESISTOR, American symbol; MANUFACTURER: Yageo; ORDERING-CODE: RC0805FR-0710KL
U1 = firefly:TCS3471; MANUFACTURER: AMS-TAOS USA Inc.; ORDERING-CODE: TCS34715FN

## Module SERIAL_WIRE_DEBUG
Ports: ATE_NRESET(io) ATE_SWDCLK(io) ATE_SWDIO(io) ATE_PWR(io) ATE_DIR_TO_DUT(io) DUT_NRESET(io) DUT_SWDCLK(io) DUT_SWDIO(io) DUT_VCC(io) ATE_SENSE_NRESET(io) GND(pwr) +3V3(pwr)
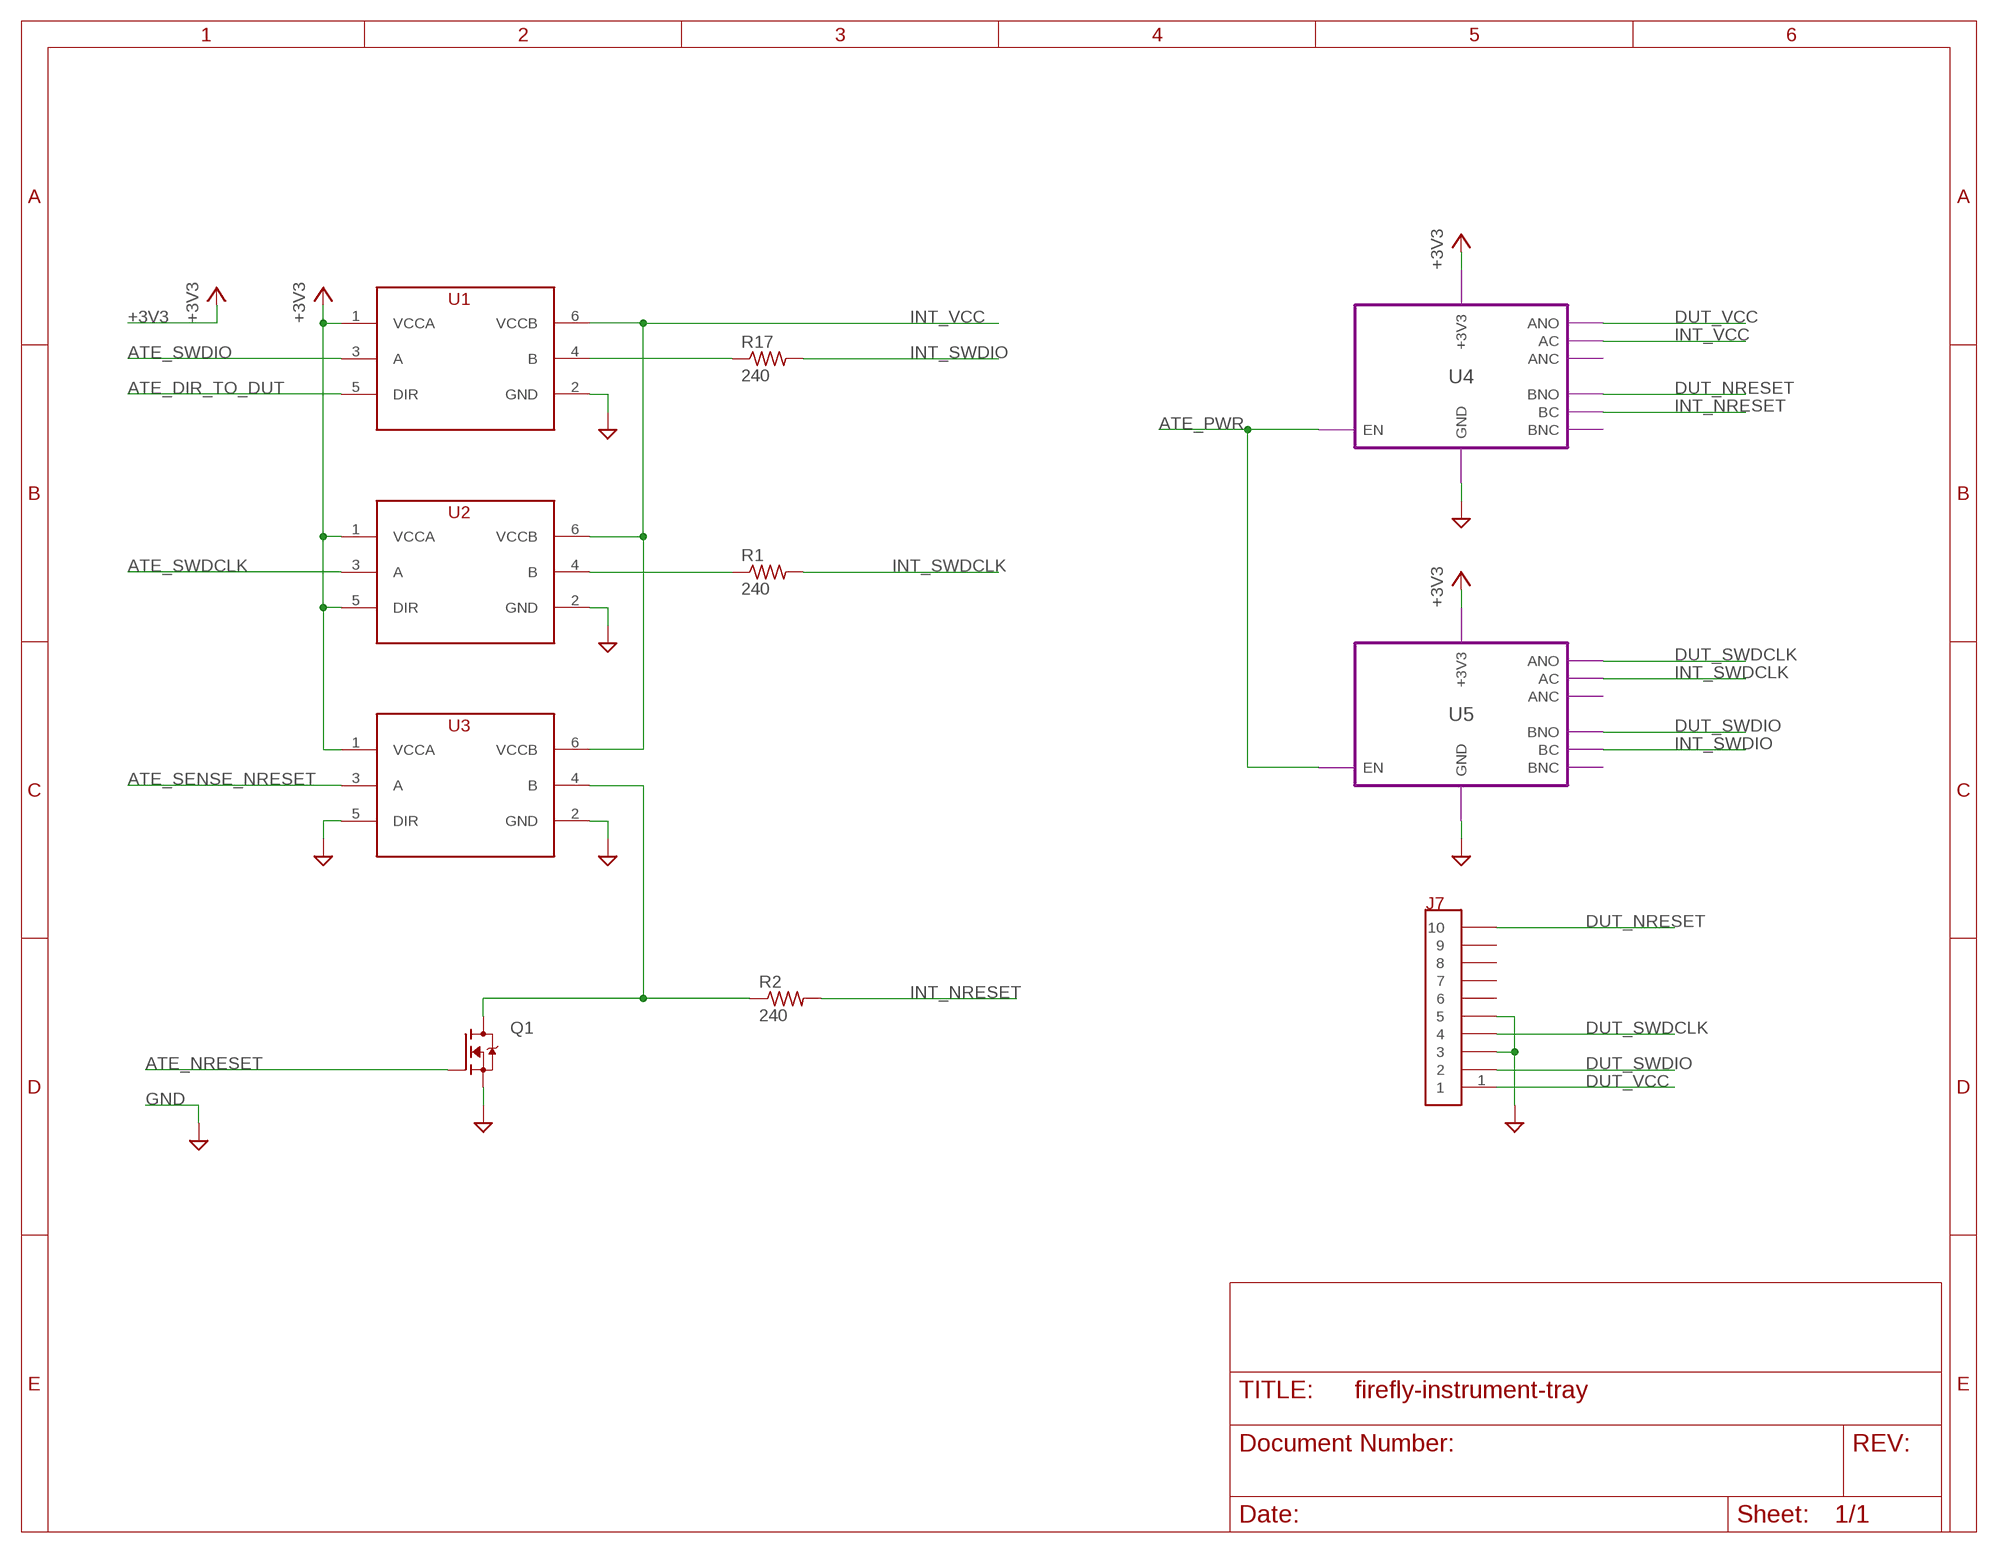
[diagram p13: schematic, module SERIAL_WIRE_DEBUG, sheet 1]

### Parts
J7  CON-10SWD  [SWD-10]
Q1  FET-NMCPH3  [MCPH3]
R1  240  R-USR0805  [R0805]
R2  240  R-USR0805  [R0805]
R17  240  R-USR0805  [R0805]
U1  74LVCH1T45  [SOT363]
U2  74LVCH1T45  [SOT363]
U3  74LVCH1T45  [SOT363]

### Module instances
U4 = RELAY
U5 = RELAY

### Nets
+3V3: U1.1(VCCA) U2.1(VCCA) U2.5(DIR) U3.1(VCCA) ; port U4.+3V3 U5.+3V3
ATE_DIR_TO_DUT: U1.5(DIR)
ATE_NRESET: Q1.1(G)
ATE_PWR: port U4.EN U5.EN
ATE_SENSE_NRESET: U3.3(A)
ATE_SWDCLK: U2.3(A)
ATE_SWDIO: U1.3(A)
DUT_NRESET: J7.10 ; port U4.BNO
DUT_SWDCLK: J7.4 ; port U5.ANO
DUT_SWDIO: J7.2 ; port U5.BNO
DUT_VCC: J7.1 ; port U4.ANO
GND: J7.3 J7.5 Q1.2(S) U1.2(GND) U2.2(GND) U3.2(GND) U3.5(DIR) ; port U5.GND U4.GND
INT_NRESET: R2.2 ; port U4.BC
INT_SWDCLK: R1.2 ; port U5.AC
INT_SWDIO: R17.2 ; port U5.BC
INT_VCC: U1.6(VCCB) U2.6(VCCB) U3.6(VCCB) ; port U4.AC
N$1: Q1.3(D) R2.1 U3.4(B)
N$2: R17.1 U1.4(B)
N$3: R1.1 U2.4(B)
Unconnected: J7.6 J7.7 J7.8 J7.9

### Library data of the parts
J7 = firefly:CON-10; MANUFACTURER: Harwin; ORDERING-CODE: M50-3500542
Q1 = firefly:FET-N; MANUFACTURER: ON Semiconductor; ORDERING-CODE: MCH3481-TL-W
R1 R2 R17 = firefly:R-US: RESISTOR, American symbol; MANUFACTURER: Yageo; ORDERING-CODE: RC0805FR-07240RL
U1-U3 = firefly:74LVCH1T45; MANUFACTURER: NXP Semiconductors; ORDERING-CODE: 74LVCH1T45GW,125